# EasyEDA Pro project 三轴测试仪快速检测系统_2024-12-14.eprj, schematic Schematic1

## Sheets
1 采集系统: Board Name: Board1; Create Date: 2024-12-13; Page Name: 采集系统; Project Name: 三轴测试仪快速检测系统_2024-12-12; Schematic Name: Schematic1; Update Date: 2024-12-13; Company: 嘉立创EDA; Page Size: A4; Version: V1.0
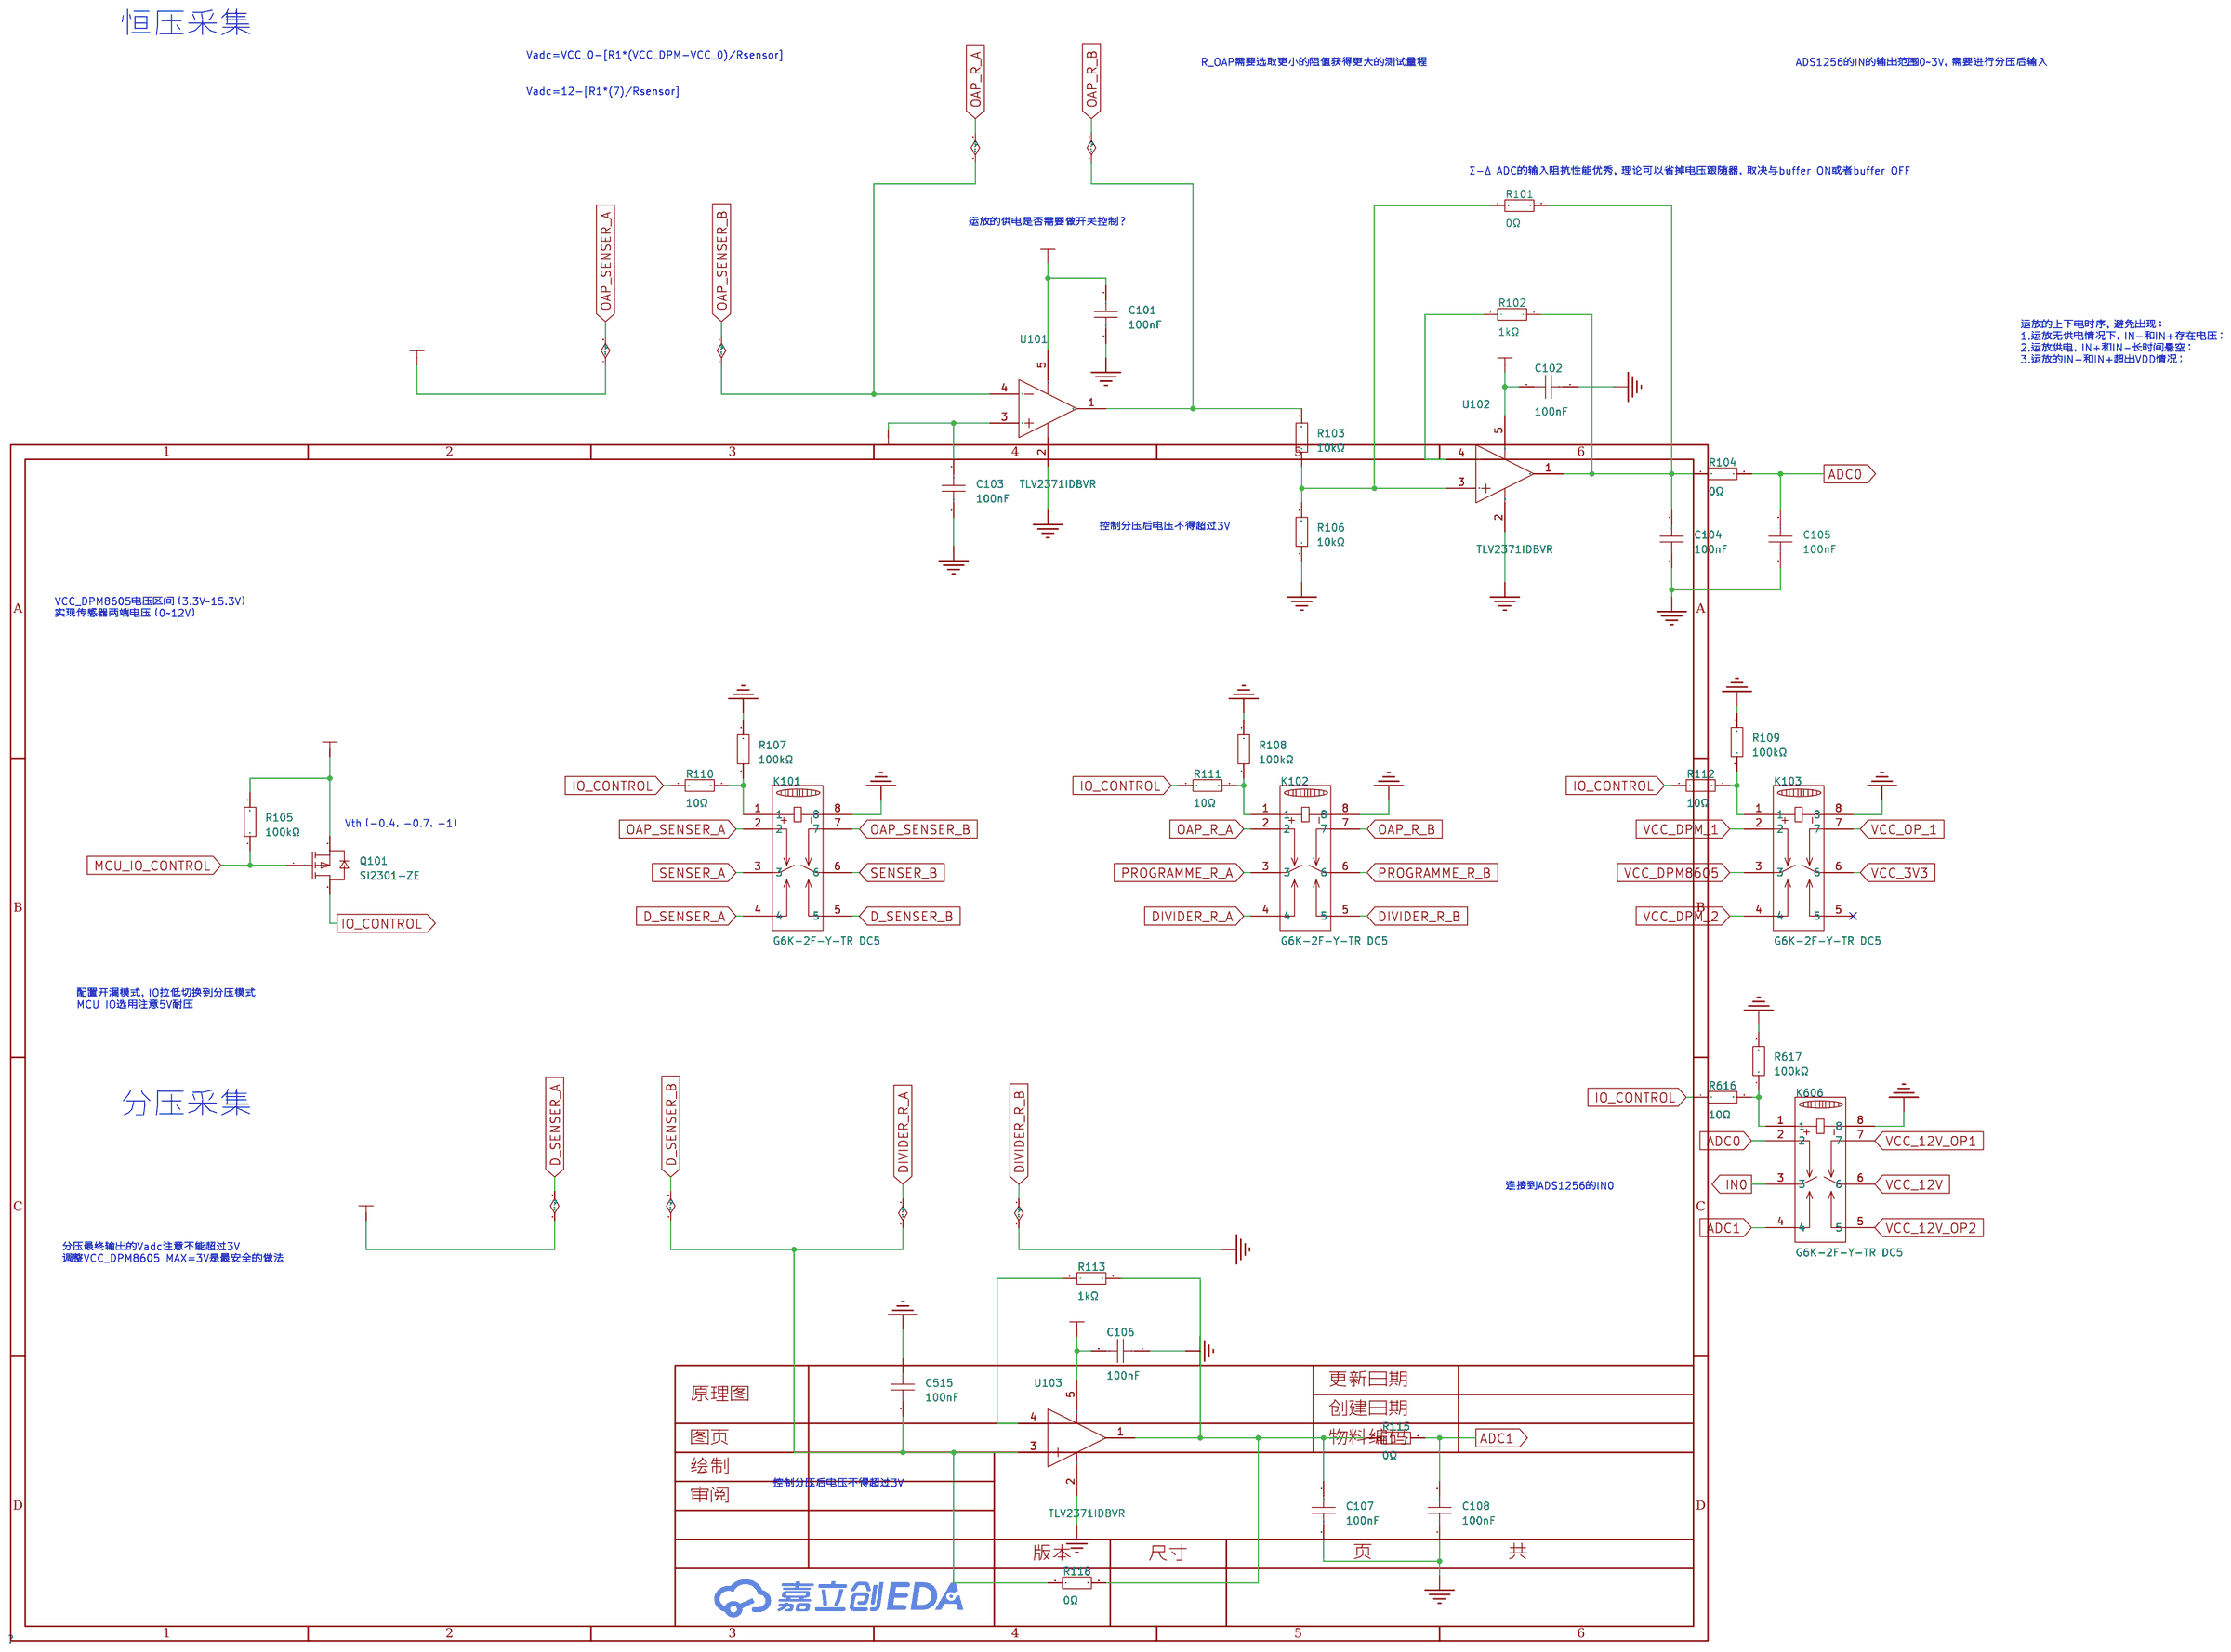
[diagram p0: 采集系统]
2 通讯部分: Page Name: 通讯部分
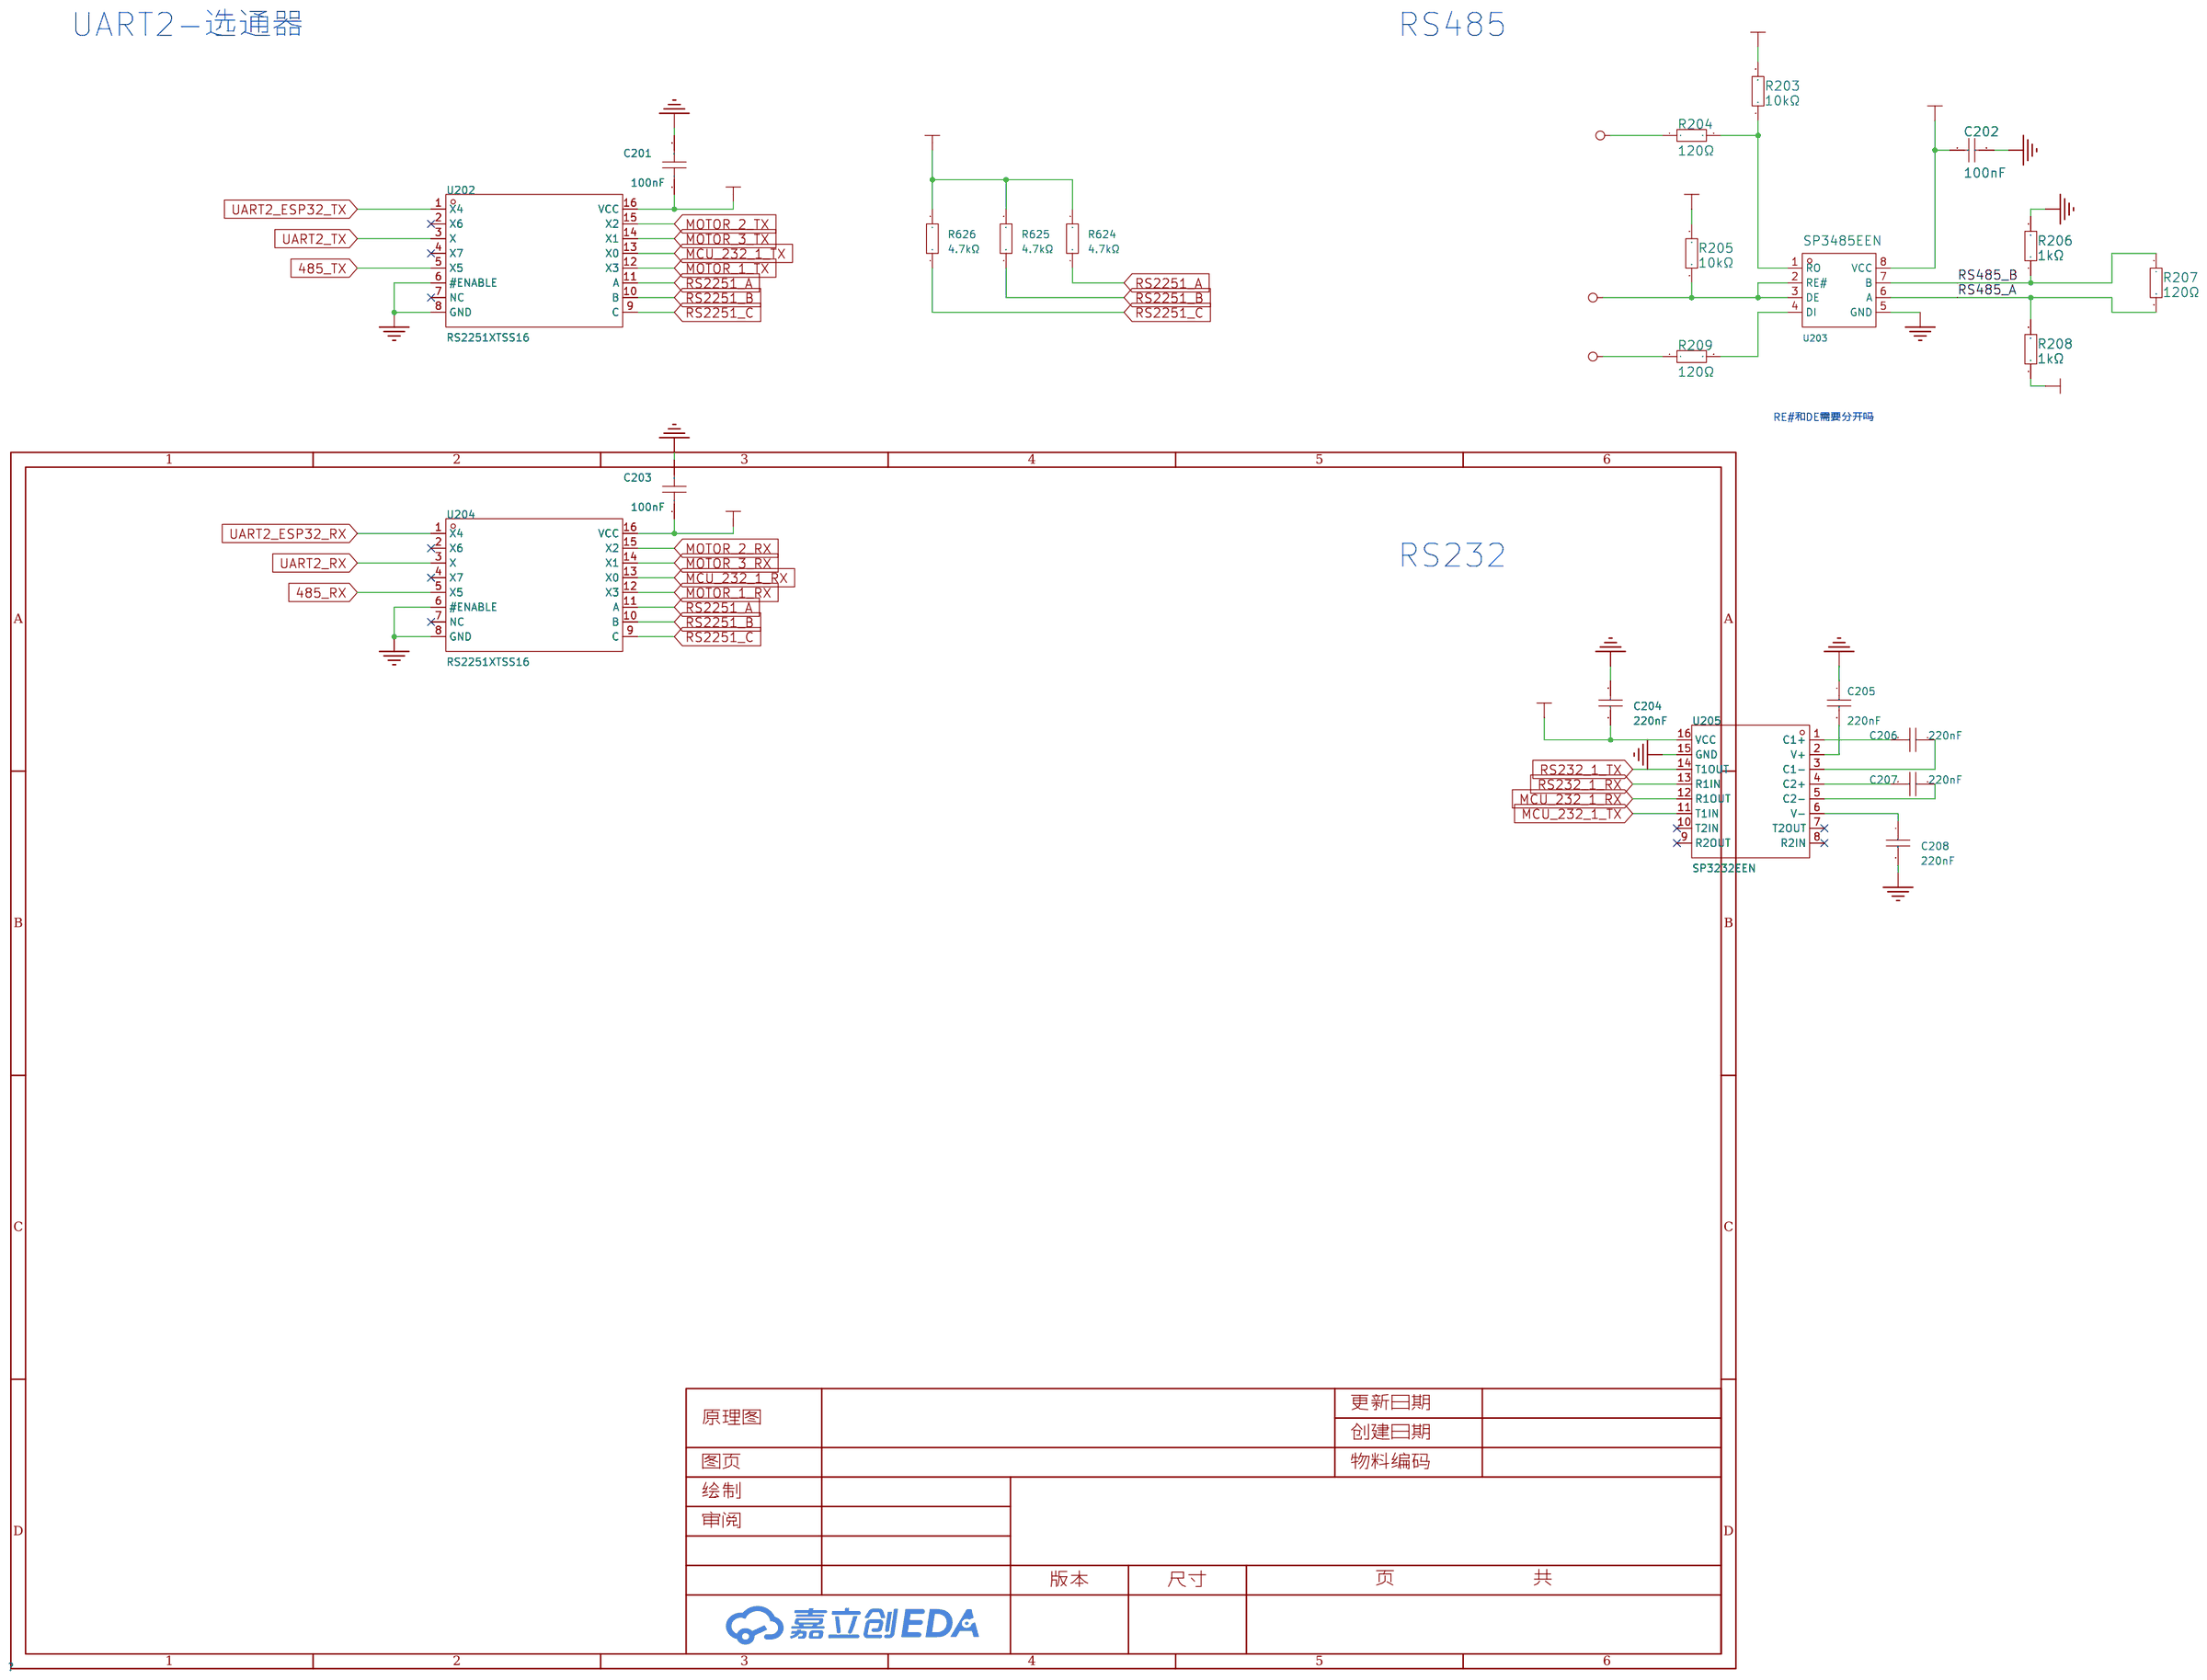
[diagram p1: 通讯部分]
3 POWER: Page Name: POWER
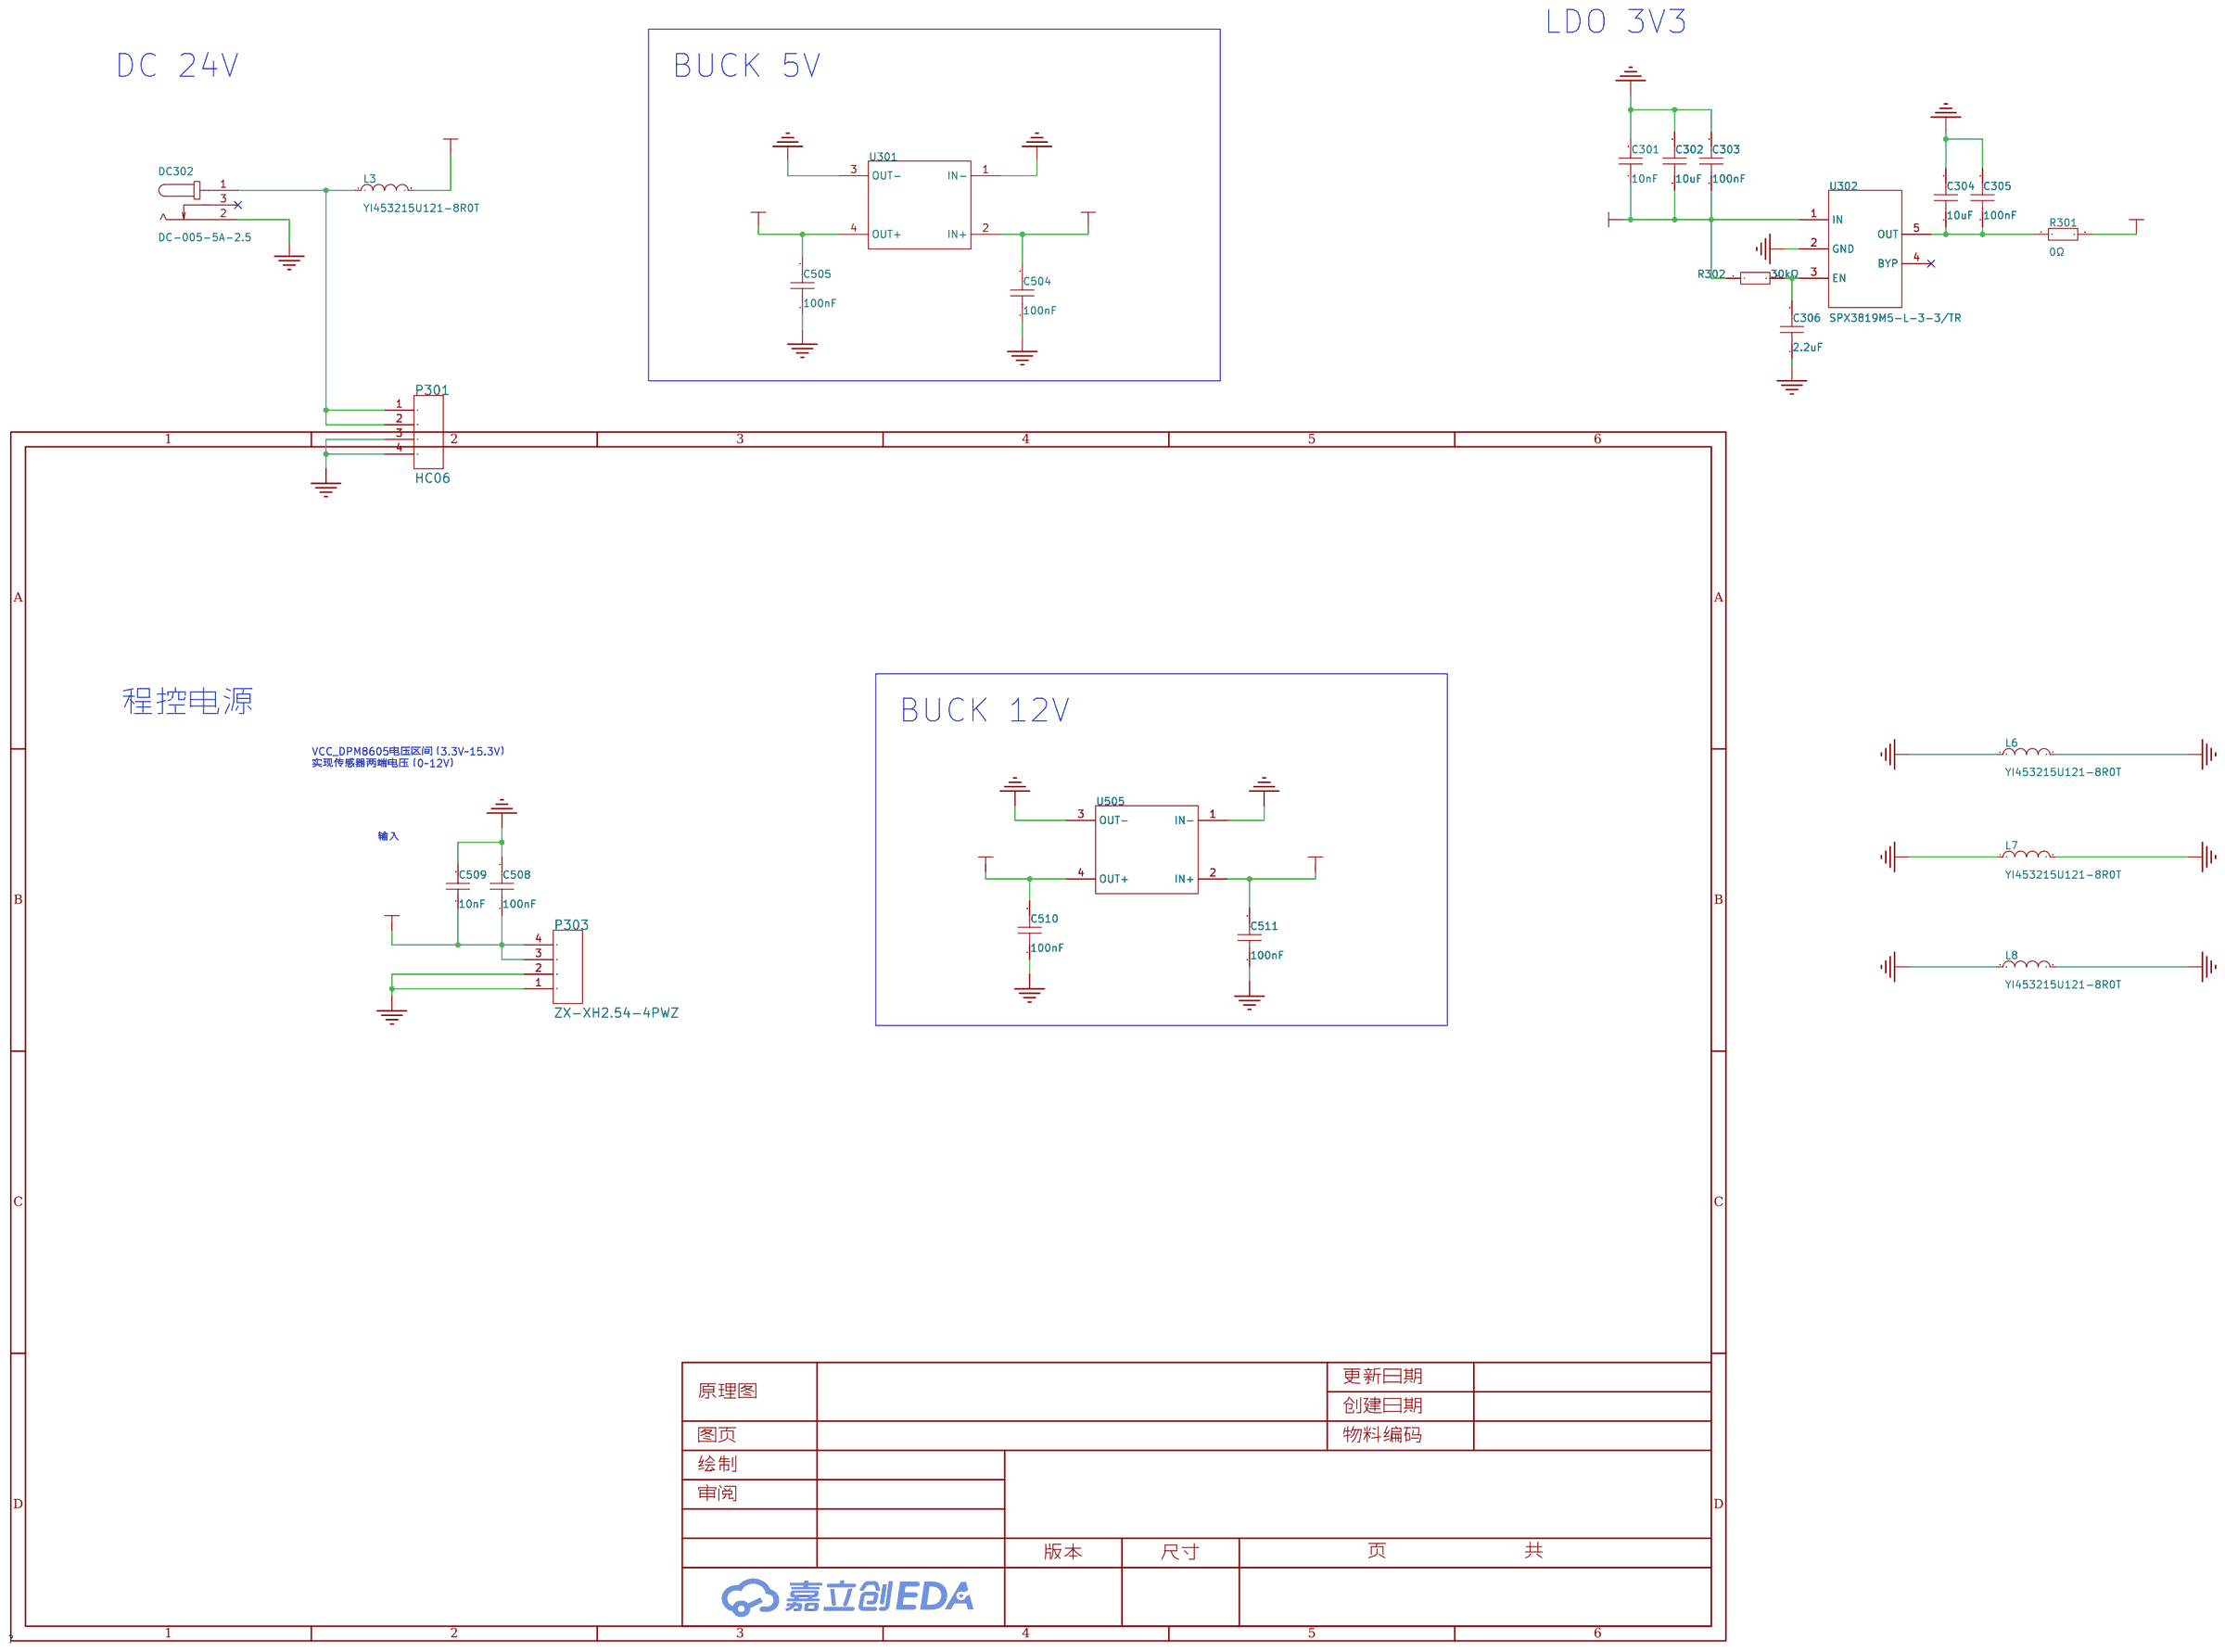
[diagram p2: POWER]
4 MCU: Create Date: 2024-12-14; Page Name: MCU; Project Name: 三轴测试仪快速检测系统_2024-12-14; Update Date: 2024-12-14
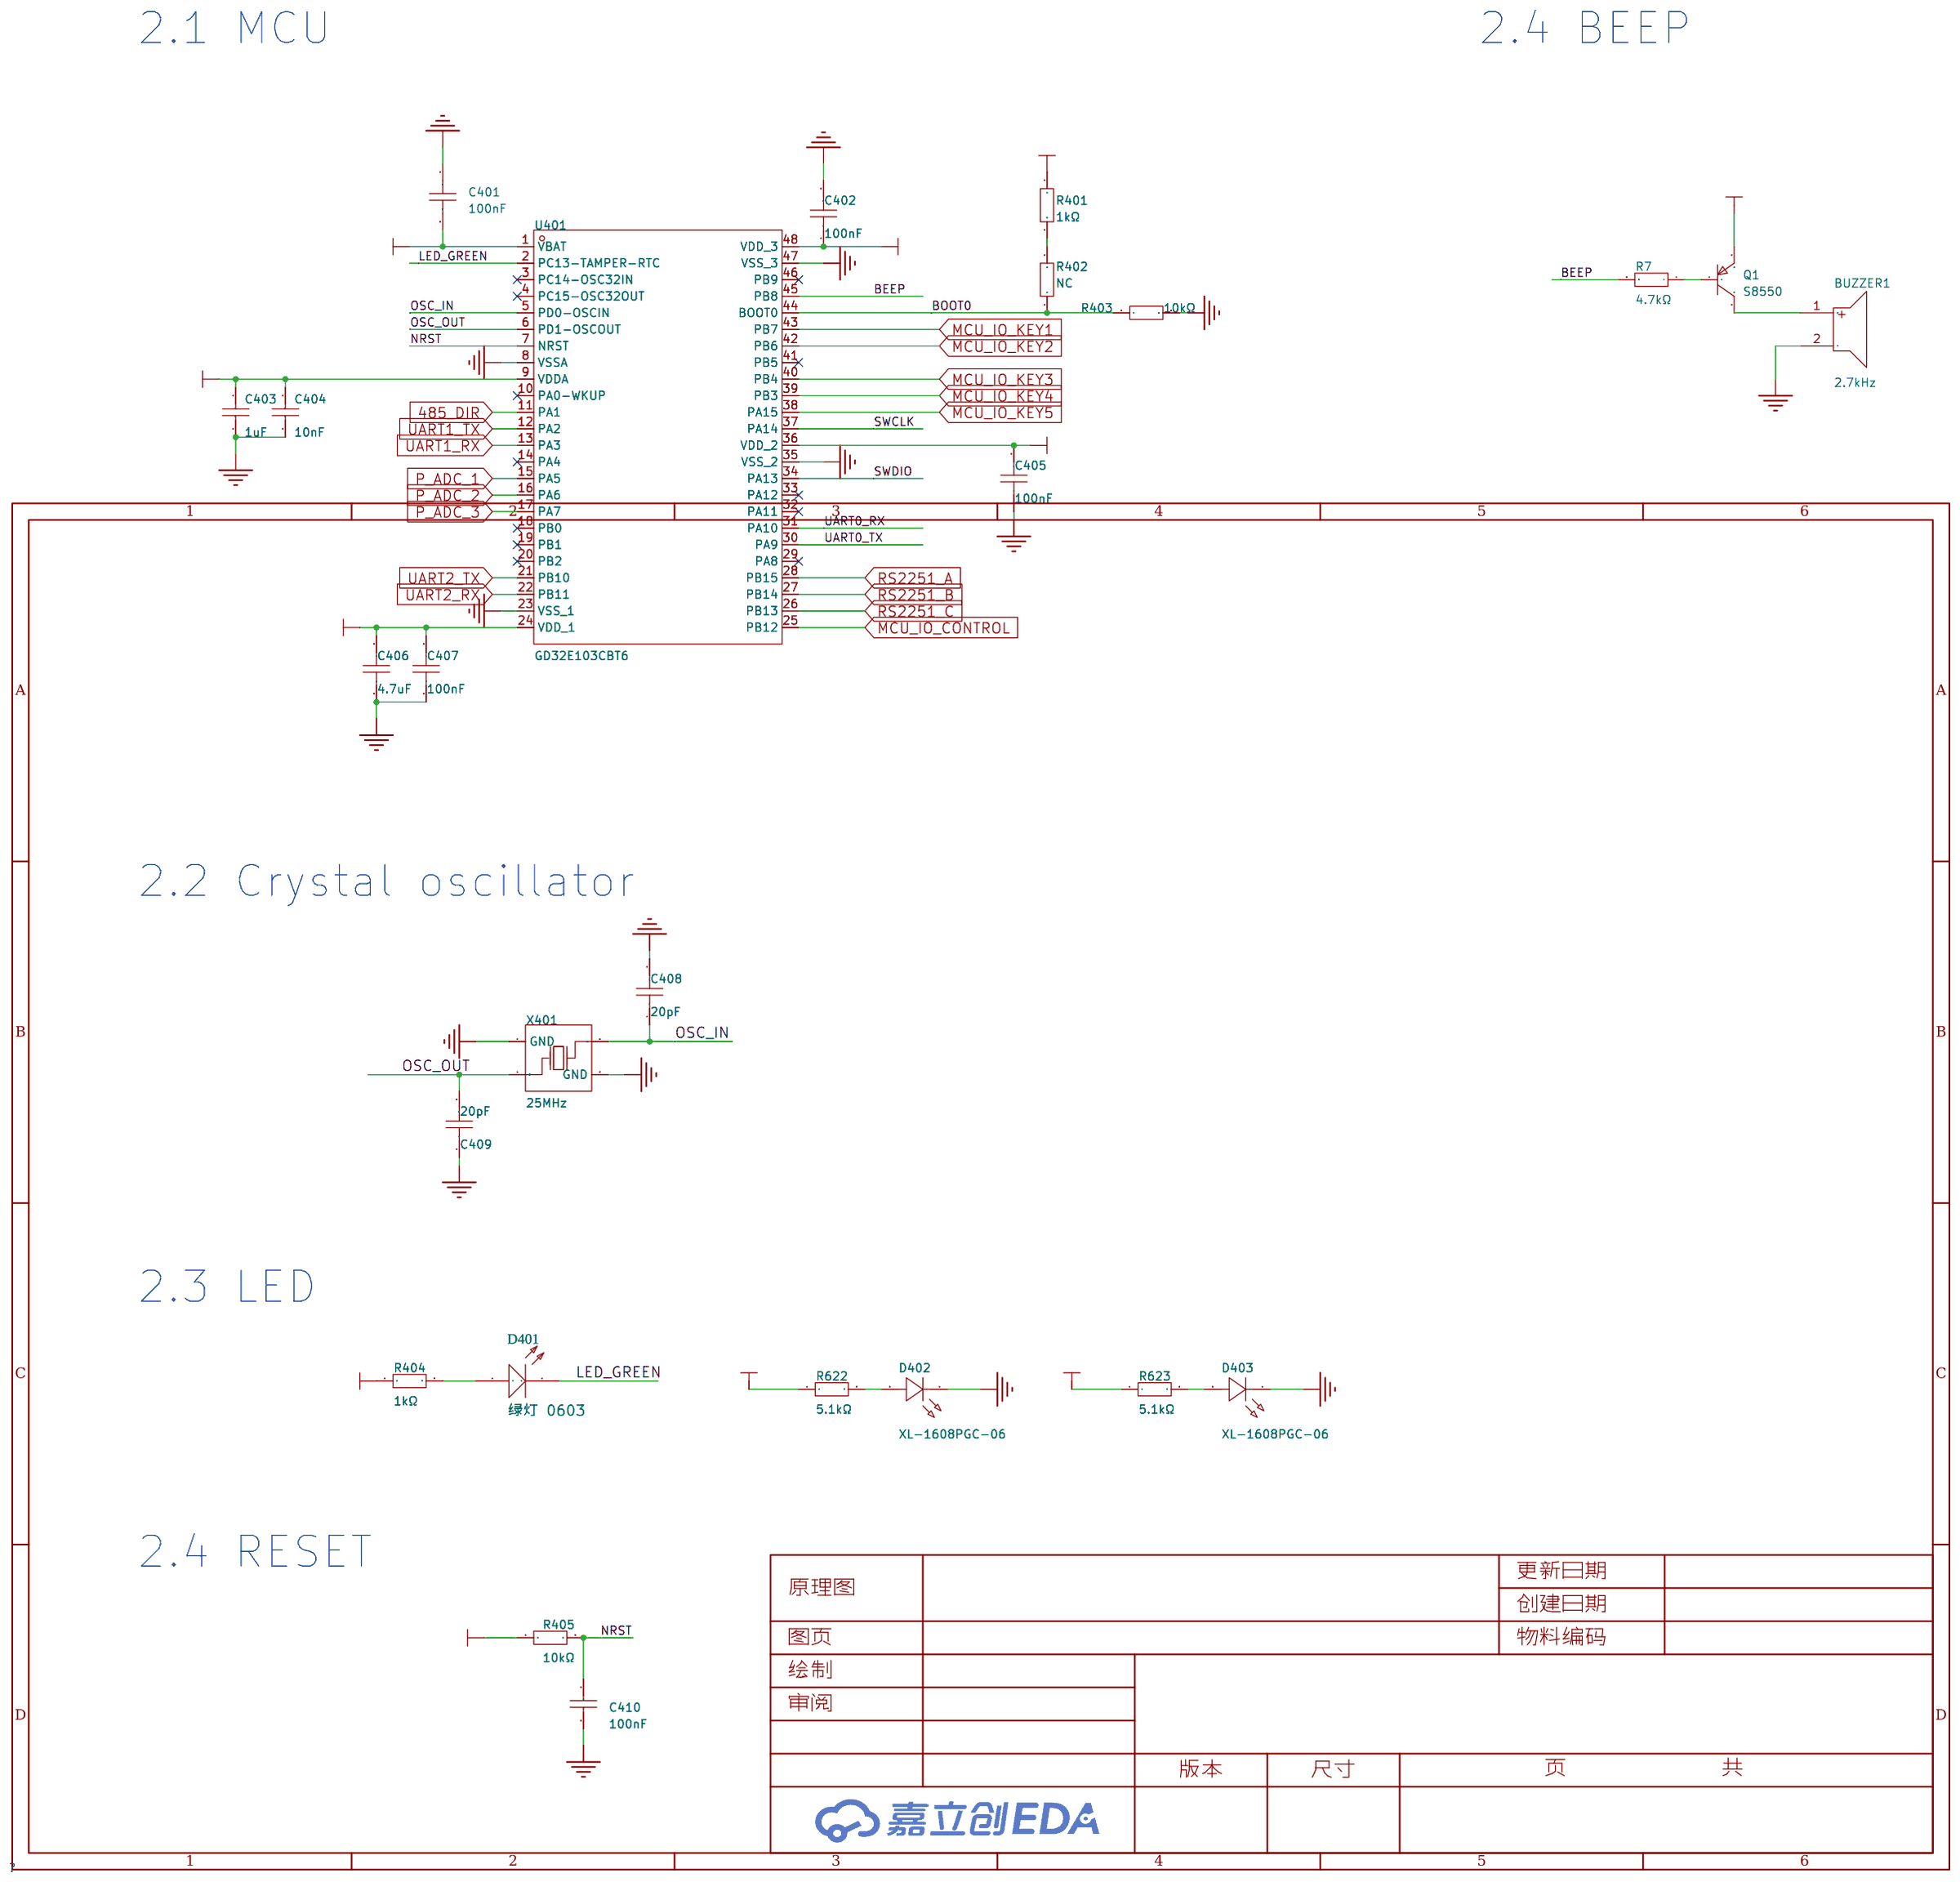
[diagram p3: MCU]
5 通讯接口: Page Name: 通讯接口
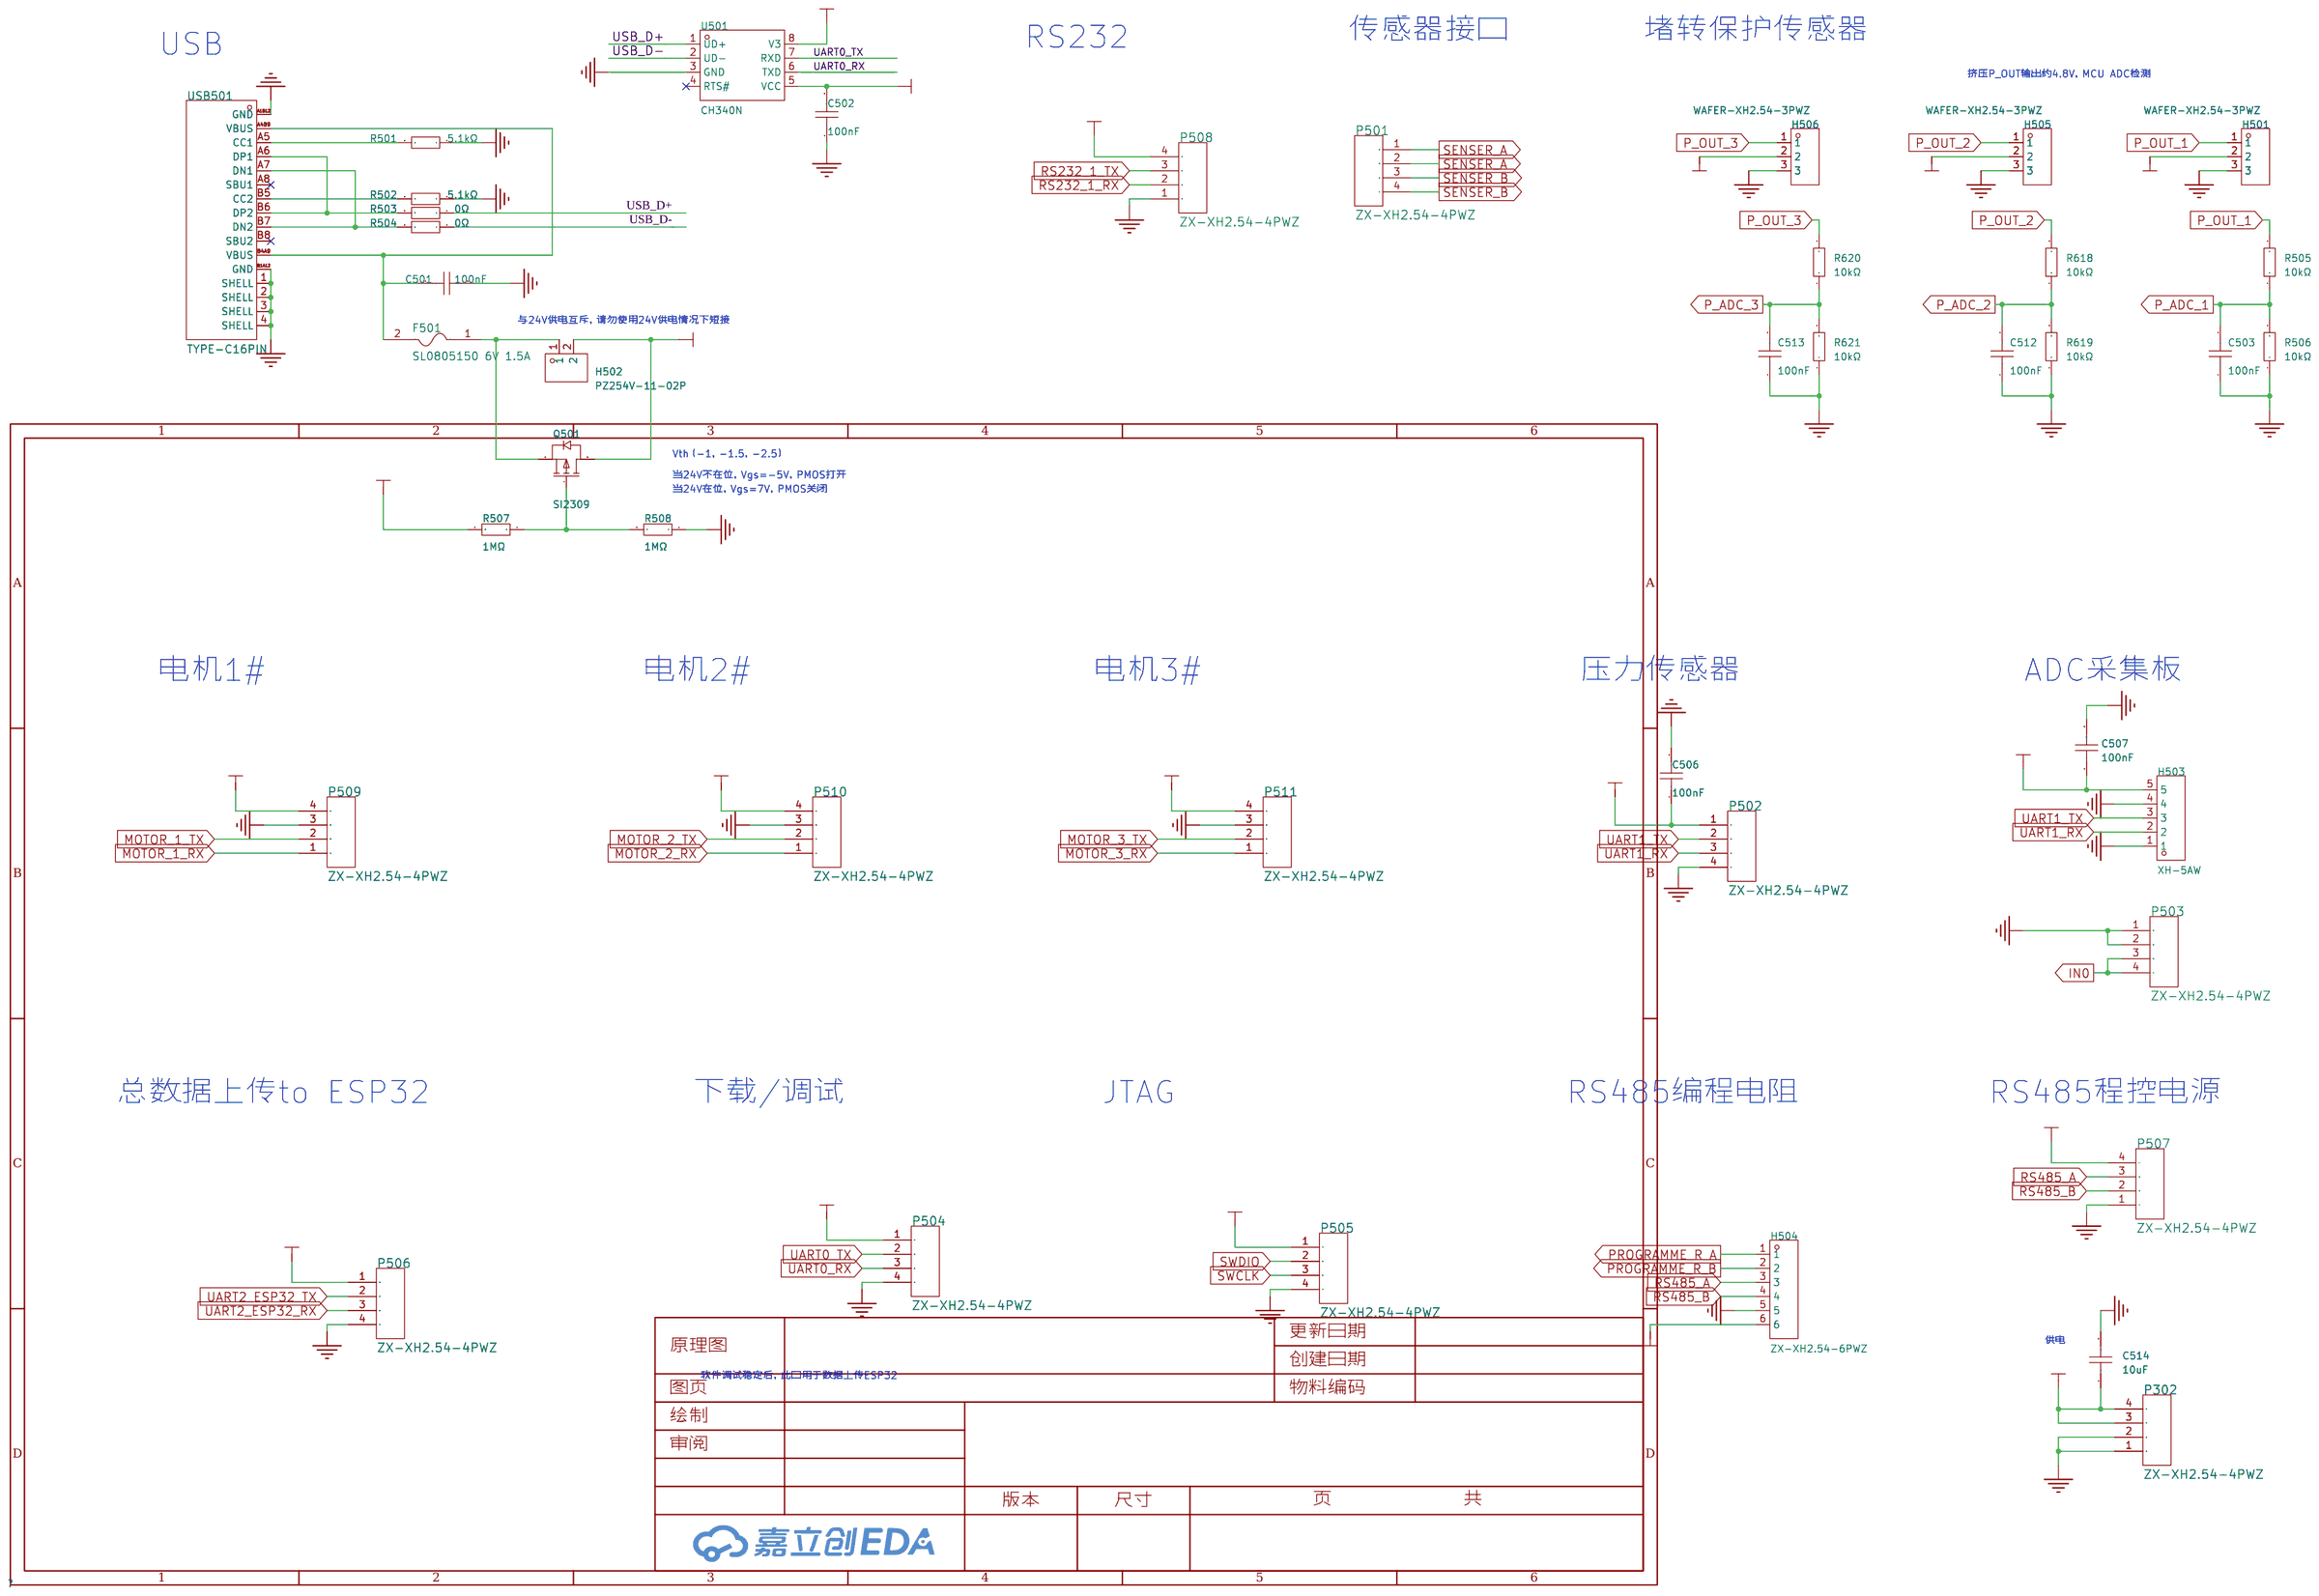
[diagram p4: 通讯接口]
6 按键接口: Create Date: 2024-12-14; Page Name: 按键接口; Project Name: 三轴测试仪快速检测系统_2024-12-14; Update Date: 2024-12-14
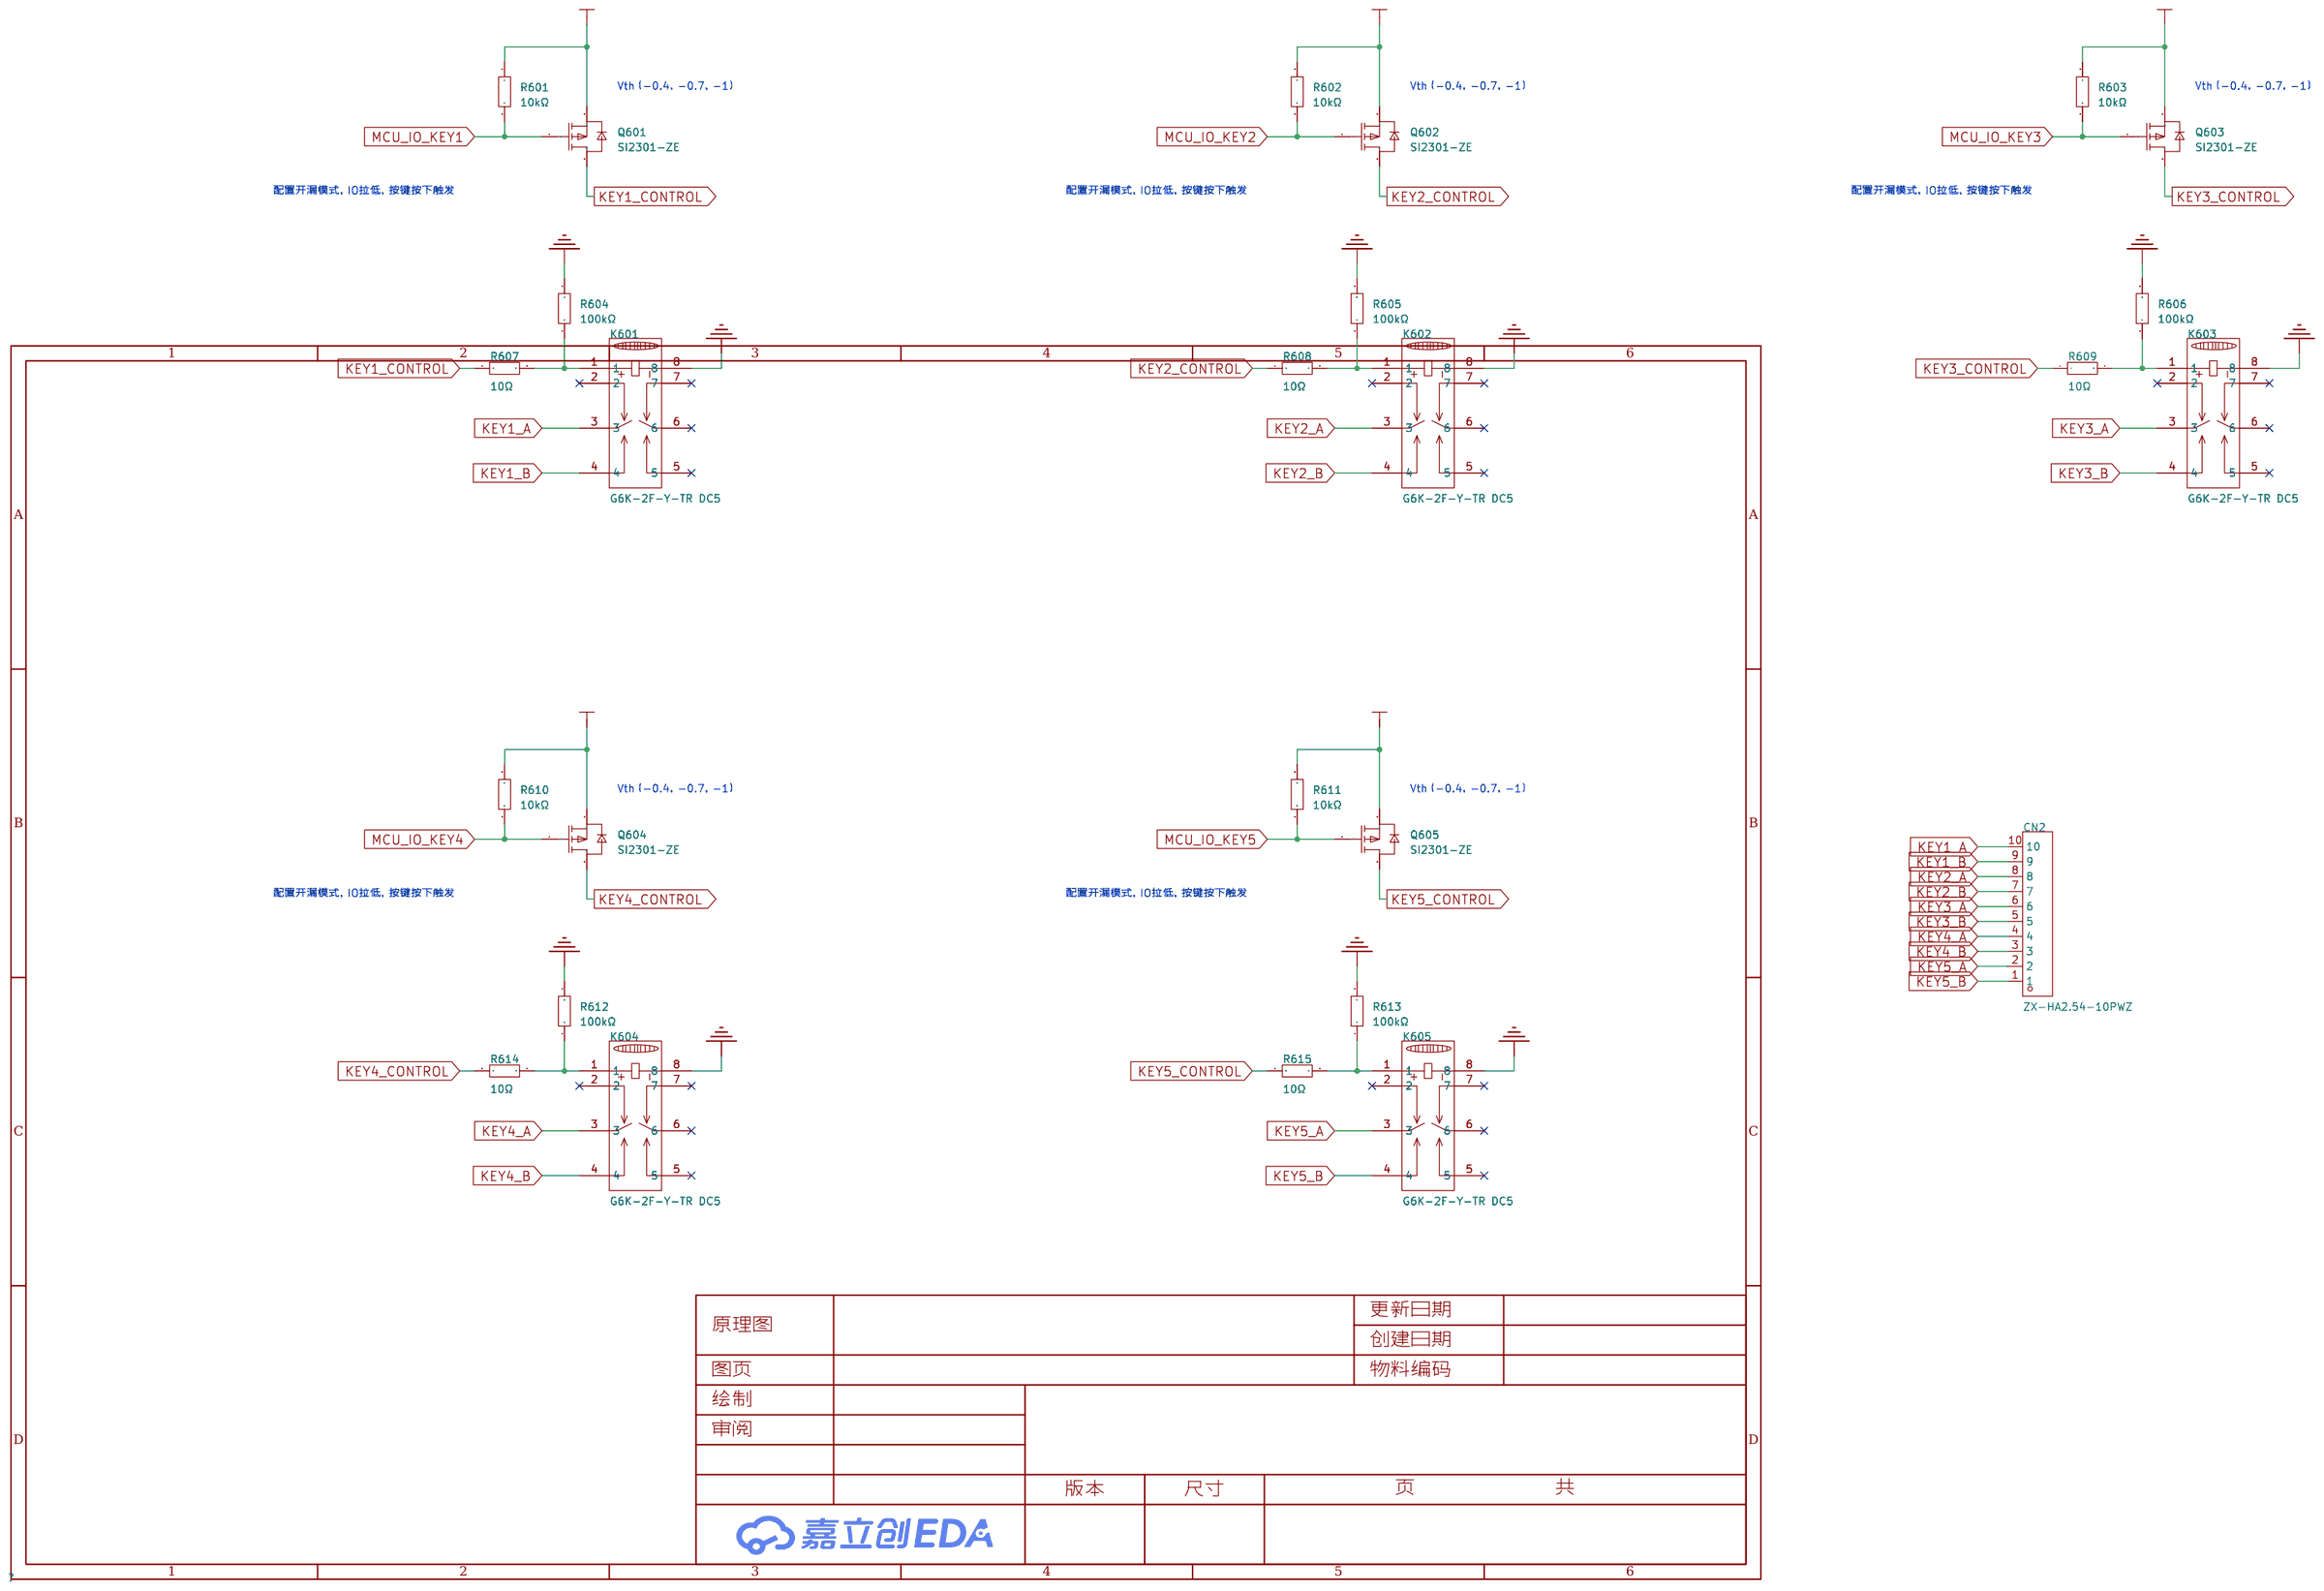
[diagram p5: 按键接口]

## Parts
sheet MCU
BUZZER1  2.7kHz  [BUZ-TH_BD9.0-P4.00-D0.6-FD]
C401  100nF  [C0402]
C402  100nF  [C0402]
C403  1uF  [C0402]
C404  10nF  [C0402]
C405  100nF  [C0402]
C406  4.7uF  [C0402]
C407  100nF  [C0402]
C408  20pF  [C0402]
C409  20pF  [C0402]
C410  100nF  [C0402]
D401  绿灯 0603  [0603_LED_S1]
D402  XL-1608PGC-06  [LED0603-RD_GREEN]
D403  XL-1608PGC-06  [LED0603-RD_GREEN]
Q1  S8550  [SOT-23-3_L2.9-W1.6-P1.90-LS2.8-BR]
R7  4.7kΩ  [R0402]
R401  1kΩ  [R0402]
R402  10kΩ  [R0201]
R403  10kΩ  [R0402]
R404  1kΩ  [R0402]
R405  10kΩ  [R0402]
R622  5.1kΩ  [R0603]
R623  5.1kΩ  [R0603]
U401  GD32E103CBT6  [LQFP-48_L7.0-W7.0-P0.50-LS9.0-BL]
X401  25MHz  [OSC-SMD_4P-L2.0-W1.6-BL]
sheet POWER
C301  10nF  [C0603]
C302  10uF  [C0603]
C303  100nF  [C0603]
C304  10uF  [C0603]
C305  100nF  [C0603]
C306  2.2uF  [C0603]
C504  100nF  [C0805]
C505  100nF  [C0603]
C508  100nF  [C0603]
C509  10nF  [C0603]
C510  100nF  [C0603]
C511  100nF  [C0805]
DC302  DC-005-5A-2.5  [DC-IN-TH_DC-005-5A-2.5]
L3  YI453215U121-8R0T  [IND-SMD_L4.5-W3.2-CBW453215U800T]
L6  YI453215U121-8R0T  [IND-SMD_L4.5-W3.2-CBW453215U800T]
L7  YI453215U121-8R0T  [IND-SMD_L4.5-W3.2-CBW453215U800T]  (no BOM)
L8  YI453215U121-8R0T  [IND-SMD_L4.5-W3.2-CBW453215U800T]  (no BOM)
P301  HC06  [HDR-TH_4P-P2.54-V-F-R1-C4]  (no BOM)
P303  ZX-XH2.54-4PWZ  [CONN-TH_4P-P2.50_ZX-XH2.54-4PWZ]
R301  0Ω  [R0603]
R302  30kΩ  [R0402]
U301  -  [DCDC_24-5]
U302  SPX3819M5-L-3-3/TR  [SOT-23-5_L3.0-W1.7-P0.95-LS2.8-BL]
U505  -  [DCDC_24-5]
sheet 按键接口
CN2  ZX-HA2.54-10PWZ  [CONN-TH_10P-P2.50_ZX-HA2.54-10PWZ]
K601  G6K-2F-Y-TR DC5  [RELAY-SMD_G6K-2F-X-XX]
K602  G6K-2F-Y-TR DC5  [RELAY-SMD_G6K-2F-X-XX]
K603  G6K-2F-Y-TR DC5  [RELAY-SMD_G6K-2F-X-XX]
K604  G6K-2F-Y-TR DC5  [RELAY-SMD_G6K-2F-X-XX]
K605  G6K-2F-Y-TR DC5  [RELAY-SMD_G6K-2F-X-XX]
Q601  SI2301-ZE  [SOT-23-3_L2.9-W1.3-P1.90-LS2.4-BR]
Q602  SI2301-ZE  [SOT-23-3_L2.9-W1.3-P1.90-LS2.4-BR]
Q603  SI2301-ZE  [SOT-23-3_L2.9-W1.3-P1.90-LS2.4-BR]
Q604  SI2301-ZE  [SOT-23-3_L2.9-W1.3-P1.90-LS2.4-BR]
Q605  SI2301-ZE  [SOT-23-3_L2.9-W1.3-P1.90-LS2.4-BR]
R601  10kΩ  [R0603]
R602  10kΩ  [R0603]
R603  10kΩ  [R0603]
R604  100kΩ  [R0603]
R605  100kΩ  [R0603]
R606  100kΩ  [R0603]
R607  10Ω  [R0603]
R608  10Ω  [R0603]
R609  10Ω  [R0603]
R610  10kΩ  [R0603]
R611  10kΩ  [R0603]
R612  100kΩ  [R0603]
R613  100kΩ  [R0603]
R614  10Ω  [R0603]
R615  10Ω  [R0603]
sheet 通讯接口
C501  100nF  [C0603]
C502  100nF  [C0402]
C503  100nF  [C0402]
C506  100nF  [C0603]
C507  100nF  [C0402]
C512  100nF  [C0402]
C513  100nF  [C0402]
C514  10uF  [C0805]
F501  SL0805150 6V 1.5A  [F0805]
H501  WAFER-XH2.54-3PWZ  [CONN-TH_3P-P2.50_WAFER-XH2.54-3PWZ]
H502  PZ254V-11-02P  [HDR-TH_2P-P2.54-V-M]
H503  XH-5AW  [CONN-TH_5P-P2.54_XH-5AW_C2908614]
H504  ZX-XH2.54-6PWZ  [CONN-TH_6P-P2.50_ZX-XH2.54-6PWZ]
H505  WAFER-XH2.54-3PWZ  [CONN-TH_3P-P2.50_WAFER-XH2.54-3PWZ]
H506  WAFER-XH2.54-3PWZ  [CONN-TH_3P-P2.50_WAFER-XH2.54-3PWZ]
P302  ZX-XH2.54-4PWZ  [CONN-TH_4P-P2.50_ZX-XH2.54-4PWZ]
P501  ZX-XH2.54-4PWZ  [CONN-TH_4P-P2.50_ZX-XH2.54-4PWZ]
P502  ZX-XH2.54-4PWZ  [CONN-TH_4P-P2.50_ZX-XH2.54-4PWZ]
P503  ZX-XH2.54-4PWZ  [CONN-TH_4P-P2.50_ZX-XH2.54-4PWZ]
P504  ZX-XH2.54-4PWZ  [CONN-TH_4P-P2.50_ZX-XH2.54-4PWZ]
P505  ZX-XH2.54-4PWZ  [CONN-TH_4P-P2.50_ZX-XH2.54-4PWZ]
P506  ZX-XH2.54-4PWZ  [CONN-TH_4P-P2.50_ZX-XH2.54-4PWZ]
P507  ZX-XH2.54-4PWZ  [CONN-TH_4P-P2.50_ZX-XH2.54-4PWZ]
P508  ZX-XH2.54-4PWZ  [CONN-TH_4P-P2.50_ZX-XH2.54-4PWZ]
P509  ZX-XH2.54-4PWZ  [CONN-TH_4P-P2.50_ZX-XH2.54-4PWZ]
P510  ZX-XH2.54-4PWZ  [CONN-TH_4P-P2.50_ZX-XH2.54-4PWZ]
P511  ZX-XH2.54-4PWZ  [CONN-TH_4P-P2.50_ZX-XH2.54-4PWZ]
Q501  SI2309  [SOT-23_L2.9-W1.3-P1.90-LS2.4-BR]
R501  5.1kΩ  [R0402]
R502  5.1kΩ  [R0402]
R503  0Ω  [R0402]
R504  0Ω  [R0402]
R505  10kΩ  [R0603]
R506  10kΩ  [R0603]
R507  1MΩ  [R0603]
R508  1MΩ  [R0603]
R618  10kΩ  [R0603]
R619  10kΩ  [R0603]
R620  10kΩ  [R0603]
R621  10kΩ  [R0603]
U501  CH340N  [SOP-8_L4.9-W3.9-P1.27-LS6.0-BL]
USB501  TYPE-C16PIN  [type-c16pin]
sheet 通讯部分
C201  100nF  [C0402]
C202  100nF  [C0402]
C203  100nF  [C0402]
C204  220nF  [C0603]
C205  220nF  [C0603]
C206  220nF  [C0603]
C207  220nF  [C0603]
C208  220nF  [C0603]
R203  10kΩ  [R0402]
R204  120Ω  [R0402]
R205  10kΩ  [R0402]
R206  1kΩ  [R0402]
R207  120Ω  [R0402]
R208  1kΩ  [R0402]
R209  120Ω  [R0402]
R624  4.7kΩ  [R0402]
R625  4.7kΩ  [R0402]
R626  4.7kΩ  [R0402]
U202  RS2251XTSS16  [TSSOP-16_L5.0-W4.4-P0.65-LS6.4-BL]
U203  SP3485EEN  [SOP-8_L5.0-W3.9-P1.27-LS6.0-BL]
U204  RS2251XTSS16  [TSSOP-16_L5.0-W4.4-P0.65-LS6.4-BL]
U205  SP3232EEN  [SOP-16_L9.9-W3.9-P1.27-LS6.0-BL]
sheet 采集系统
C101  100nF  [C0402]
C102  100nF  [C0402]
C103  100nF  [C0402]
C104  100nF  [C0603]  (no BOM)
C105  100nF  [C0603]  (no BOM)
C106  100nF  [C0402]
C107  100nF  [C0603]  (no BOM)
C108  100nF  [C0603]  (no BOM)
C515  100nF  [C0402]  (no BOM)
K101  G6K-2F-Y-TR DC5  [RELAY-SMD_G6K-2F-X-XX]
K102  G6K-2F-Y-TR DC5  [RELAY-SMD_G6K-2F-X-XX]
K103  G6K-2F-Y-TR DC5  [RELAY-SMD_G6K-2F-X-XX]
K606  G6K-2F-Y-TR DC5  [RELAY-SMD_G6K-2F-X-XX]
Q101  SI2301-ZE  [SOT-23-3_L2.9-W1.3-P1.90-LS2.4-BR]
R101  0Ω  [R0603]  (no BOM)
R102  1kΩ  [R0603]
R103  10kΩ  [R0603]
R104  0Ω  [R0603]
R105  100kΩ  [R0603]
R106  10kΩ  [R0603]
R107  100kΩ  [R0603]
R108  100kΩ  [R0603]
R109  100kΩ  [R0603]
R110  10Ω  [R0603]
R111  10Ω  [R0603]
R112  10Ω  [R0603]
R113  1kΩ  [R0603]
R115  0Ω  [R0603]
R118  0Ω  [R0603]  (no BOM)
R616  10Ω  [R0603]
R617  100kΩ  [R0603]
U101  TLV2371IDBVR  [SOT-23-5_L3.0-W1.7-P0.95-LS2.8-BR]
U102  TLV2371IDBVR  [SOT-23-5_L3.0-W1.7-P0.95-LS2.8-BR]
U103  TLV2371IDBVR  [SOT-23-5_L3.0-W1.7-P0.95-LS2.8-BR]

## Library data of the parts
BUZZER1 = QMB-09B-03: 驱动方式:无源(外部驱动);构造类型:电磁式;频率:2.7kHz;声压(SPL):85dB@3V,10cm;; LCSC Part Name: 无源蜂鸣器QMB-09B-03; Supplier Part: C96256; Manufacturer: 华能; Supplier Footprint: 插件,D=9mm; JLCPCB Part Class: 扩展库; Datasheet: https://atta.szlcsc.com/upload/public/pdf/source/20210401/C96256_958B17753B5AD7CBFBCFFC7C095B4484.pdf; Supplier: LCSC; Oscillator Circuit: 无源(外部驱动); Technology Type: 电磁式; Operating Voltage: 2V~5V; Sound Pressure Level (SPL): 85dB@3V,10cm; Diameter (φD): 9mm; Height: 5.7mm
C101-C103 C106 C401 C402 C405 C407 C410 C502 C503 C507 C512 C513 C515 = CL05B104KO5NNNC: 容值:100nF;精度:±10%;额定电压:16V;材质(温度系数):X7R;; LCSC Part Name: 100nF ±10% 16V; Supplier Part: C1525; Manufacturer: SAMSUNG(三星); Supplier Footprint: 0402; JLCPCB Part Class: Basic Part; Datasheet: https://atta.szlcsc.com/upload/public/pdf/source/20160218/1457707763339.pdf; Supplier: LCSC; Tolerance: ±10%; Voltage Rated: 16V; Temperature Coefficient: X7R
C403 = CL05A105KA5NQNC: LCSC Part Name: 1uF ±10% 25V; Supplier Part: C52923; Manufacturer: SAMSUNG(三星); Supplier Footprint: 0402; JLCPCB Part Class: Basic Part; Datasheet: https://atta.szlcsc.com/upload/public/pdf/source/20160218/1457707763339.pdf; Supplier: LCSC; Tolerance: ±10%; Voltage Rated: 25V; Temperature Coefficient: X5R
C404 = CL05B103KB5NNNC: LCSC Part Name: 10nF ±10% 50V; Supplier Part: C15195; Manufacturer: SAMSUNG(三星); Supplier Footprint: 0402; JLCPCB Part Class: Basic Part; Datasheet: https://atta.szlcsc.com/upload/public/pdf/source/20160218/1457707763339.pdf; Supplier: LCSC; Tolerance: ±10%; Voltage Rated: 50V; Temperature Coefficient: X7R
C406 = CL05A475MQ5NRNC: 容值:4.7uF;精度:±20%;额定电压:6.3V;材质(温度系数):X5R;; LCSC Part Name: 4.7uF ±20% 6.3V; Supplier Part: C307423; Manufacturer: SAMSUNG(三星); Supplier Footprint: 0402; JLCPCB Part Class: 扩展库; Datasheet: https://atta.szlcsc.com/upload/public/pdf/source/20181010/C307423_0E0C4E35F3A09F81C2E5C84E00499E42.pdf; Supplier: LCSC; Tolerance: ±20%; Voltage Rated: 6.3V; Temperature Coefficient: X5R
C408 C409 = 0402CG200J500NT: LCSC Part Name: 20pF ±5% 50V; Supplier Part: C1554; Manufacturer: FH(风华); Supplier Footprint: 0402; JLCPCB Part Class: Basic Part; Datasheet: https://atta.szlcsc.com/upload/public/pdf/source/20200305/C486355_26A10D38EF8C2A5C37091D0039909270.pdf; Supplier: LCSC; Tolerance: ±5%; Voltage Rated: 50V; Temperature Coefficient: C0G
D401 = 绿灯 0603: 发光二极管; ComponentLink1Description: 供应商链接; ComponentLink1URL: http://www.szlcsc.com/product/details_73152.html; Supplier: LC; SuppliersPartNumber: C72043; Design Item ID: 0603 绿灯; Library Name: 32x64_GD32E103VBT6
D402 D403 = XL-1608PGC-06: 灯头类型:-;发光颜色:翠绿色;正向电压(VF):2.6V~3V;功率:75mW;正向电流:5mA;主波长:505nm~540nm;二极管配置:-;透镜颜色:绿色透镜;色温:-;发光强度:299mcd;发光角度:130°;载带方式:正贴;工作温度:-;; Supplier Part: C7371905; Manufacturer: XINGLIGHT(成兴光); Supplier Footprint: 0603; JLCPCB Part Class: 扩展库; Datasheet: https://atta.szlcsc.com/upload/public/pdf/source/20240218/2F8A7AF596DEEB38157DAB7856E382C0.pdf; Supplier: LCSC; Emitted Color: 翠绿色; Forward Voltage (VF): 2.6V~3V; Power Dissipation: 75mW; Forward Current: 5mA; Dominant Wavelength: 505nm~540nm; Peak Wavelength: 530nm; Lens Color: 绿色透镜; Luminous Intensity: 299mcd; Viewing Angle: 130°; Mounting Sytle: 正贴
Q1 = S8550_C105432: 晶体管类型:PNP;集电极电流(Ic):500mA;集射极击穿电压(Vceo):25V;功率(Pd):300mW;直流电流增益(hFE@Ic,Vce):120@50mA,1V;; LCSC Part Name: S8550(RANGE:120-200) L档120-200; Supplier Part: C105432; Manufacturer: CJ(江苏长电/长晶); Supplier Footprint: SOT-23; JLCPCB Part Class: 基础库; Datasheet: https://atta.szlcsc.com/upload/public/pdf/source/20171228/C164891_15144412930301213894.pdf; Supplier: LCSC; Transistor Type: PNP; Collector Current (Ic): 500mA; Collector-Emitter Breakdown Voltage (Vceo): 25V; Power Dissipation (Pd): 300mW; DC Current Gain (hFE@Ic,Vce): 120@50mA,1V; Transition Frequency (fT): 150MHz; Collector Cut-Off Current (Icbo): 100nA; Collector-Emitter Saturation Voltage (VCE(sat)@Ic,Ib): 600mV@500mA,50mA
R7 R624-R626 = 0402WGF4701TCE: 电阻类型:厚膜电阻;阻值:4.7kΩ;精度:±1%;功率:62.5mW;最大工作电压:50V;温度系数:±100ppm/℃;; LCSC Part Name: 4.7kΩ ±1% 62.5mW 厚膜电阻; Supplier Part: C25900; Manufacturer: UNI-ROYAL(厚声); Supplier Footprint: 0402; JLCPCB Part Class: 基础库; Datasheet: https://atta.szlcsc.com/upload/public/pdf/source/20200306/C422600_1E6D84923E4A46A82E41ADD87F860B5C.pdf; Supplier: LCSC; Type: 厚膜电阻; Tolerance: ±1%; Power(Watts): 62.5mW; Overload Voltage (Max): 50V; Temperature Coefficient: ±100ppm/℃; Operating Temperature Range: -55℃~+155℃
R401 R404 = 0402WGF1001TCE: 电阻类型:厚膜电阻;阻值:1kΩ;精度:±1%;功率:62.5mW;最大工作电压:50V;温度系数:±100ppm/℃;; LCSC Part Name: 1kΩ ±1% 62.5mW 厚膜电阻; Supplier Part: C11702; Manufacturer: UNI-ROYAL(厚声); Supplier Footprint: 0402; JLCPCB Part Class: Basic Part; Datasheet: https://atta.szlcsc.com/upload/public/pdf/source/20200306/C422600_1E6D84923E4A46A82E41ADD87F860B5C.pdf; Supplier: LCSC; Type: 厚膜电阻; Tolerance: ±1%; Power(Watts): 62.5mW; Overload Voltage (Max): 50V; Temperature Coefficient: ±100ppm/℃; Operating Temperature Range: -55℃~+155℃
R402 = 0201WMF1002TEE: 电阻类型:厚膜电阻;阻值:10kΩ;精度:±1%;功率:50mW;最大工作电压:25V;温度系数:±200ppm/℃;; LCSC Part Name: 10kΩ ±1% 50mW 厚膜电阻; Supplier Part: C473048; Manufacturer: UNI-ROYAL(厚声); Supplier Footprint: 0201; JLCPCB Part Class: Extended Part; Datasheet: https://atta.szlcsc.com/upload/public/pdf/source/20200306/C422600_1E6D84923E4A46A82E41ADD87F860B5C.pdf; Supplier: LCSC; Type: 厚膜电阻; Tolerance: ±1%; Power(Watts): 50mW; Overload Voltage (Max): 25V; Temperature Coefficient: ±200ppm/℃; Operating Temperature Range: -55℃~+155℃
R403 R405 = 0402WGF1002TCE: 电阻类型:厚膜电阻;阻值:10kΩ;精度:±1%;功率:62.5mW;最大工作电压:50V;温度系数:±100ppm/℃;; LCSC Part Name: 10kΩ ±1% 62.5mW 厚膜电阻; Supplier Part: C25744; Manufacturer: UNI-ROYAL(厚声); Supplier Footprint: 0402; JLCPCB Part Class: Basic Part; Datasheet: https://atta.szlcsc.com/upload/public/pdf/source/20200306/C422600_1E6D84923E4A46A82E41ADD87F860B5C.pdf; Supplier: LCSC; Type: 厚膜电阻; Tolerance: ±1%; Power(Watts): 62.5mW; Overload Voltage (Max): 50V; Temperature Coefficient: ±100ppm/℃; Operating Temperature Range: -55℃~+155℃
R622 R623 = 0603WAF5101T5E: 电阻类型:厚膜电阻;阻值:5.1kΩ;精度:±1%;功率:100mW;最大工作电压:75V;温度系数:±100ppm/℃;; LCSC Part Name: 5.1kΩ ±1% 100mW 厚膜电阻; Supplier Part: C23186; Manufacturer: UNI-ROYAL(厚声); Supplier Footprint: 0603; JLCPCB Part Class: 基础库; Datasheet: https://atta.szlcsc.com/upload/public/pdf/source/20200306/C422600_1E6D84923E4A46A82E41ADD87F860B5C.pdf; Supplier: LCSC; Type: 厚膜电阻; Tolerance: ±1%; Power(Watts): 100mW; Overload Voltage (Max): 75V; Temperature Coefficient: ±100ppm/℃; Operating Temperature Range: -55℃~+155℃
U401 = GD32E103CBT6: LCSC Part Name: GD32E103CBT6 带CAN功能; Supplier Part: C2914253; Manufacturer: GigaDevice(兆易创新); Supplier Footprint: LQFP-48(7x7); JLCPCB Part Class: 扩展库; Datasheet: https://atta.szlcsc.com/upload/public/pdf/source/20201126/C350804_062D726FF1FE88D99C7604784B8D351C.pdf; Supplier: LCSC
X401 = 7F25000E20UCG: 晶振类型:贴片晶振;频率:25MHz;常温频差:±10ppm;外接负载电容:20pF;频率稳定度(全温):±30ppm;; LCSC Part Name: 25MHz ±10ppm 20pF; Supplier Part: C252274; Manufacturer: SJK(晶科鑫); Supplier Footprint: SMD2016-4P; JLCPCB Part Class: 扩展库; Datasheet: https://atta.szlcsc.com/upload/public/pdf/source/20220727/136062879A4A4DBFAFAE0FC3C83033A6.pdf; Supplier: LCSC; Crystal Type: 贴片晶振; Normal temperature Frequency Tolerance: ±10ppm; External load capacitor: 20pF; Frequency Stability(Full temperature range): ±30ppm; Operating Temperature: -40℃~+85℃
C301 C509 = 0603B103K500NT: 容值:10nF;精度:±10%;额定电压:50V;材质(温度系数):X7R;; LCSC Part Name: 10nF ±10% 50V; Supplier Part: C57112; Manufacturer: FH(风华); Supplier Footprint: 0603; JLCPCB Part Class: 基础库; Datasheet: https://atta.szlcsc.com/upload/public/pdf/source/20200305/C486355_26A10D38EF8C2A5C37091D0039909270.pdf; Supplier: LCSC; Tolerance: ±10%; Voltage Rated: 50V; Temperature Coefficient: X7R
C302 C304 = CL10A106MA8NRNC: 容值:10uF;精度:±20%;额定电压:25V;材质(温度系数):X5R;; LCSC Part Name: 10uF ±20% 25V; Supplier Part: C96446; Manufacturer: SAMSUNG(三星); Supplier Footprint: 0603; JLCPCB Part Class: 基础库; Datasheet: https://atta.szlcsc.com/upload/public/pdf/source/20160218/1457707763339.pdf; Supplier: LCSC; Tolerance: ±20%; Voltage Rated: 25V; Temperature Coefficient: X5R
C104 C105 C107 C108 C303 C305 C501 C505 C506 C508 C510 = CC0603KRX7R9BB104: 容值:100nF;精度:±10%;额定电压:50V;材质(温度系数):X7R;; LCSC Part Name: 100nF ±10% 50V; Supplier Part: C14663; Manufacturer: YAGEO(国巨); Supplier Footprint: 0603; JLCPCB Part Class: 基础库; Datasheet: https://atta.szlcsc.com/upload/public/pdf/source/20180910/C282072_33301C7F631E79921B82A8DAC6BCC5B3.pdf; Supplier: LCSC; Tolerance: ±10%; Voltage Rated: 50V; Temperature Coefficient: X7R
C306 = CL10A225KO8NNNC: 容值:2.2uF;精度:±10%;额定电压:16V;材质(温度系数):X5R;; LCSC Part Name: 2.2uF ±10% 16V; Supplier Part: C23630; Manufacturer: SAMSUNG(三星); Supplier Footprint: 0603; JLCPCB Part Class: Basic Part; Datasheet: https://atta.szlcsc.com/upload/public/pdf/source/20160218/1457707763339.pdf; Supplier: LCSC; Tolerance: ±10%; Voltage Rated: 16V; Temperature Coefficient: X5R
C504 C511 = CC0805KRX7R9BB104: 容值:100nF;精度:±10%;额定电压:50V;材质(温度系数):X7R;; LCSC Part Name: 100nF ±10% 50V; Supplier Part: C49678; Manufacturer: YAGEO(国巨); Supplier Footprint: 0805; JLCPCB Part Class: Basic Part; Datasheet: https://atta.szlcsc.com/upload/public/pdf/source/20180224/C181747_15194369449651363981.pdf; Supplier: LCSC; Tolerance: ±10%; Voltage Rated: 50V; Temperature Coefficient: X7R
DC302 = DC-005-5A-2.5: 连接器类型:DC电源插座;安装方式:弯插;触点内径:2.5mm;触点外径:6.5mm;额定电流:5A;额定电压:24V;工作温度范围:-20℃~+70℃;; LCSC Part Name: DC电源插座 内径:2.5mm 外径:6.5mm; Supplier Part: C381115; Manufacturer: XKB Connection(中国星坤); Supplier Footprint: 插件; JLCPCB Part Class: 扩展库; Datasheet: https://atta.szlcsc.com/upload/public/pdf/source/20220930/9F6B678D272419D8FE16D336E354A545.pdf; Supplier: LCSC; Connector Type: DC电源插座; Mounting Style: 弯插; Inside Contact Diameter: 2.5mm; Outside Contact Diameter: 6.5mm; Current Rating (Max): 5A; Voltage Rating (Max): 24V; Operating Temperature Range: -20℃~+70℃
L3 L6-L8 = YI453215U121-8R0T: 标称阻抗@测试频率:120Ω@100MHz;误差:±25%;直流电阻(RDC):10mΩ;; LCSC Part Name: 单路 1812磁珠 阻抗120Ω@100MHz; Supplier Part: C2858475; Manufacturer: YJYCOIN(益嘉源); Supplier Footprint: 1812; JLCPCB Part Class: 扩展库; Datasheet: https://atta.szlcsc.com/upload/public/pdf/source/20240109/C374FA4277F6E3A7C5BC25517D50BA8B.pdf; Supplier: LCSC; Impedance @ Frequency: 120Ω@100MHz; Tolerance: ±25%; DC Resistance: 10mΩ; Current Rating: 8A; Circuits: 1
P301 = HC06: Library Name: EMOWHH Make
P303 = ZX-XH2.54-4PWZ: 插针结构:1x4P;间距:2.54mm;安装方式:弯插;参考系列:XH;总PIN数:4P;排数:1;每排PIN数:4;行距:-;额定电流:3A;触头材质:黄铜;触头镀层:锡;工作温度范围:-25℃~+85℃;; Supplier Part: C7429643; Manufacturer: Megastar(兆星); Supplier Footprint: 弯插,P=2.54mm; JLCPCB Part Class: 扩展库; Datasheet: https://atta.szlcsc.com/upload/public/pdf/source/20230619/8DC602C7BA46C153FF1BE89D90453879.pdf; Supplier: LCSC; Pins Structure: 1x4P; Pitch: 2.54mm; Mounting Style: 弯插; Reference Series: XH; Number of Pins: 4P; Number of Rows: 1; Number of PINs Per Row: 4; Current Rating (Max): 3A; Contact Material: 黄铜; Contact Plating: 锡; Operating Temperature Range: -25℃~+85℃
R101 R104 R115 R118 R301 = 0603WAF0000T5E: 电阻类型:厚膜电阻;阻值:0Ω;精度:±1%;功率:100mW;最大工作电压:75V;; LCSC Part Name: 0Ω ±1% 100mW 厚膜电阻; Supplier Part: C21189; Manufacturer: UNI-ROYAL(厚声); Supplier Footprint: 0603; JLCPCB Part Class: 基础库; Datasheet: https://atta.szlcsc.com/upload/public/pdf/source/20200306/C422600_1E6D84923E4A46A82E41ADD87F860B5C.pdf; Supplier: LCSC; Type: 厚膜电阻; Tolerance: ±1%; Power(Watts): 100mW; Overload Voltage (Max): 75V; Operating Temperature Range: -55℃~+155℃
R302 = 0402WGF3002TCE: 电阻类型:厚膜电阻;阻值:30kΩ;精度:±1%;功率:62.5mW;最大工作电压:50V;温度系数:±100ppm/℃;; LCSC Part Name: 30kΩ ±1% 62.5mW 厚膜电阻; Supplier Part: C25776; Manufacturer: UNI-ROYAL(厚声); Supplier Footprint: 0402; JLCPCB Part Class: Extended Part; Datasheet: https://atta.szlcsc.com/upload/public/pdf/source/20200306/C422600_1E6D84923E4A46A82E41ADD87F860B5C.pdf; Supplier: LCSC; Type: 厚膜电阻; Tolerance: ±1%; Power(Watts): 62.5mW; Overload Voltage (Max): 50V; Temperature Coefficient: ±100ppm/℃; Operating Temperature Range: -55℃~+155℃
U301 U505 = DCDC_24-5模块: 焊盘2.2*3mm
U302 = SPX3819M5-L-3-3/TR: 输出类型:固定;最大输入电压:16V;输出电压:3.3V;输出电流:500mA;电源纹波抑制比(PSRR):70dB;输出极性:正极;; LCSC Part Name: 输入16V 输出3.3V 500mA; Supplier Part: C9055; Manufacturer: MaxLinear(迈凌); Supplier Footprint: SOT-23-5; JLCPCB Part Class: 扩展库; Datasheet: https://atta.szlcsc.com/upload/public/pdf/source/20150720/1457707331934.pdf; Supplier: LCSC; Output Type: 固定; Maximum Input Voltage: 16V; Output Voltage: 3.3V; Output Current: 500mA; Power Supply Rejection Ratio (PSRR): 70dB; Dropout Voltage: 700mV@(500mA); standby current: 8uA; Feature: 防静电保护；热保护(TSD)；过流保护(OCP)；带使能; Operating Temperature: -40℃~+125℃; Output Polarity: 正极; Number of Outputs: 1
CN2 = ZX-HA2.54-10PWZ: 插针结构:1x10P;间距:2.54mm;安装方式:弯插;参考系列:XH;总PIN数:10P;排数:1;每排PIN数:10;行距:-;额定电流:3A;触头材质:黄铜;触头镀层:锡;工作温度范围:-25℃~+85℃;; LCSC Part Name: 1x10P 间距:2.54mm 弯插 系列:XH/HA带扣; Supplier Part: C7429631; Manufacturer: Megastar(兆星); Supplier Footprint: 弯插,P=2.54mm; JLCPCB Part Class: 扩展库; Datasheet: https://atta.szlcsc.com/upload/public/pdf/source/20230619/D29CADD263BD71E104B200E9D39A0A9C.pdf; Supplier: LCSC; Pins Structure: 1x10P; Pitch: 2.54mm; Mounting Style: 弯插; Reference Series: XH; Number of Pins: 10P; Number of Rows: 1; Number of PINs Per Row: 10; Current Rating (Max): 3A; Contact Material: 黄铜; Contact Plating: 锡; Operating Temperature Range: -25℃~+85℃
K101-K103 K601-K606 = G6K-2F-Y-TR DC5: 线圈电压:5V;触点形式:两组转换:2C(双刀双掷-转换);触点容量(电阻负载):-;最大切换电压:125V@AC；60V@DC;最大切换电流:1A;; Supplier Part: C47190; Manufacturer: OMRON(欧姆龙); Supplier Footprint: SMD,6.5x10mm; JLCPCB Part Class: 扩展库; Datasheet: https://atta.szlcsc.com/upload/public/pdf/source/20220125/C1876770_53E5491D4B68F29C4BBD8118E9BAE0E8.pdf; Supplier: LCSC; Coil Voltage: 5V; Contact Form: 两组转换:2C(双刀双掷-转换); Maximum Switching Voltage: 125V@AC；60V@DC; Contact Material: 银+镀金; Maximum Switching Current: 1A; Operate Time: 3ms; Release Time: 3ms; Operating Temperature: -40℃~+70℃
Q101 Q601-Q605 = SI2301-ZE: 类型:P沟道;漏源电压(Vdss):20V;连续漏极电流(Id):2.3A;功率(Pd):700mW;导通电阻(RDS(on)@Vgs,Id):126mΩ@4.5V;阈值电压(Vgs(th)@Id):1V@250uA;; LCSC Part Name: P沟道 耐压:20V 电流:2.3A; Supplier Part: C5261052; Manufacturer: HXY MOSFET(华轩阳电子); Supplier Footprint: SOT-23; Datasheet: https://atta.szlcsc.com/upload/public/pdf/source/20230515/2FF2907841563ED329594D3237822724.pdf; Supplier: LCSC; Type: P沟道; Drain Source Voltage (Vdss): 20V; Continuous Drain Current (Id): 2.3A; Power Dissipation (Pd): 700mW; Drain Source On Resistance (RDS(on)@Vgs,Id): 126mΩ@4.5V; Gate Threshold Voltage (Vgs(th)@Id): 1V@250uA; Input Capacitance (Ciss@Vds): 285pF
R103 R106 R505 R506 R601-R603 R610 R611 R618-R621 = 0603WAF1002T5E: 电阻类型:厚膜电阻;阻值:10kΩ;精度:±1%;功率:100mW;最大工作电压:75V;温度系数:±100ppm/℃;; LCSC Part Name: 厚膜电阻 10kΩ ±1% 100mW; Supplier Part: C25804; Manufacturer: UNI-ROYAL(厚声); Supplier Footprint: 0603; JLCPCB Part Class: 基础库; Datasheet: https://atta.szlcsc.com/upload/public/pdf/source/20200306/C422600_1E6D84923E4A46A82E41ADD87F860B5C.pdf; Supplier: LCSC; Type: 厚膜电阻; Tolerance: ±1%; Power(Watts): 100mW; Overload Voltage (Max): 75V; Temperature Coefficient: ±100ppm/℃; Operating Temperature Range: -55℃~+155℃
R107-R109 R604-R606 R612 R613 R617 = 0603WAF1003T5E: 电阻类型:厚膜电阻;阻值:100kΩ;精度:±1%;功率:100mW;最大工作电压:75V;温度系数:±100ppm/℃;; LCSC Part Name: 100kΩ ±1% 100mW 厚膜电阻; Supplier Part: C25803; Manufacturer: UNI-ROYAL(厚声); Supplier Footprint: 0603; JLCPCB Part Class: 基础库; Datasheet: https://atta.szlcsc.com/upload/public/pdf/source/20200306/C422600_1E6D84923E4A46A82E41ADD87F860B5C.pdf; Supplier: LCSC; Type: 厚膜电阻; Tolerance: ±1%; Power(Watts): 100mW; Overload Voltage (Max): 75V; Temperature Coefficient: ±100ppm/℃; Operating Temperature Range: -55℃~+155℃
R110-R112 R607-R609 R614-R616 = 0603WAF100JT5E: 电阻类型:厚膜电阻;阻值:10Ω;精度:±1%;功率:100mW;最大工作电压:75V;温度系数:±400ppm/℃;; LCSC Part Name: 10Ω ±1% 100mW 厚膜电阻; Supplier Part: C22859; Manufacturer: UNI-ROYAL(厚声); Supplier Footprint: 0603; JLCPCB Part Class: 基础库; Datasheet: https://atta.szlcsc.com/upload/public/pdf/source/20200306/C422600_1E6D84923E4A46A82E41ADD87F860B5C.pdf; Supplier: LCSC; Type: 厚膜电阻; Tolerance: ±1%; Power(Watts): 100mW; Overload Voltage (Max): 75V; Temperature Coefficient: ±400ppm/℃; Operating Temperature Range: -55℃~+155℃
C514 = GRM21BR61H106KE43L: 容值:10uF;精度:±10%;额定电压:50V;材质(温度系数):X5R;; LCSC Part Name: 10uF ±10% 50V; Supplier Part: C440198; Manufacturer: muRata(村田); Supplier Footprint: 0805; JLCPCB Part Class: 基础库; Datasheet: https://atta.szlcsc.com/upload/public/pdf/source/20230811/95AAE0C9AF55EDC31B7A4D8B733F534E.pdf; Supplier: LCSC; Tolerance: ±10%; Voltage Rated: 50V; Temperature Coefficient: X5R
F501 = SL0805150 6V 1.5A: Supplier: LCSC; Manufacturer: TECHFUSE; Manufacturer Part: SL0805150; Supplier Part: C70156; JLCPCB Part Class: Extended Part; Design Item ID: SL0805150; Library Name: chaoning_Integrated_Library
H501 H505 H506 = WAFER-XH2.54-3PWZ: 插针结构:1x3P;间距:2.54mm;安装方式:弯插;总PIN数:3P;排数:1;每排PIN数:3;额定电流:2A;工作温度范围:-25℃~+85℃;; LCSC Part Name: XH 2.54mm 1x3P 弯插; Supplier Part: C5374806; Manufacturer: XUNPU(讯普); Supplier Footprint: 弯插,P=2.5mm; JLCPCB Part Class: Extended Part; Supplier: LCSC; Pins Structure: 1x3P; Pitch: 2.54mm; Mounting Style: 弯插; Number of Pins: 3P; Number of Rows: 1; Number of PINs Per Row: 3; Current Rating (Max): 2A; Operating Temperature Range: -25℃~+85℃
H502 = PZ254V-11-02P: 插针结构:1x2P;间距:2.54mm;行距:-;圆针/方针:方针;安装类型:直插;排数:单排;总PIN位数:2P;额定电流:-;额定电压:-;配合针长度:6mm;塑高:2.5mm;端接针长度:3mm;触头材质:黄铜;触头镀层:-;工作温度范围:-40℃~+105℃;颜色:黑色;; LCSC Part Name: 间距:2.54mm 1x2P 直插 方针; Supplier Part: C492401; Manufacturer: XFCN(兴飞); Supplier Footprint: 插件,P=2.54mm; JLCPCB Part Class: 扩展库; Datasheet: https://atta.szlcsc.com/upload/public/pdf/source/20200309/C492401_A812433581A9B211A7FFA413ADDFF0E5.pdf; Supplier: LCSC; Pin Structure: 1x2P; Pitch: 2.54mm; Circluar Pins/Square Pins: 方针; Mounting Type: 直插; Number of Rows: 单排; Number of Pins: 2P; Length of Mating Pin: 6mm; Insulation Height: 2.5mm; Length of End Connection Pin: 3mm; Contact Material: 黄铜; Operating Temperature Range: -40℃~+105℃; Color: 黑色
H503 = XH-5AW: 插针结构:1x5P;间距:2.54mm;安装方式:弯插;参考系列:XH;总PIN数:5P;排数:1;每排PIN数:5;行距:-;额定电流:3A;触头材质:黄铜;触头镀层:锡;工作温度范围:-25℃~+85℃;; LCSC Part Name: 1x5P 间距:2.54mm 弯插 系列:XH; Supplier Part: C2908614; Manufacturer: HCTL(华灿天禄); Supplier Footprint: 弯插,P=2.5mm; JLCPCB Part Class: Extended Part; Datasheet: https://atta.szlcsc.com/upload/public/pdf/source/20230711/B565BAF3B11666EF6B81B3605408F2BD.pdf; Supplier: LCSC; Pins Structure: 1x5P; Pitch: 2.54mm; Mounting Style: 弯插; Reference Series: XH; Number of Pins: 5P; Number of Rows: 1; Number of PINs Per Row: 5; Current Rating (Max): 3A; Contact Material: 黄铜; Contact Plating: 锡; Operating Temperature Range: -25℃~+85℃
H504 = ZX-XH2.54-6PWZ: 插针结构:1x6P;间距:2.54mm;安装方式:弯插;参考系列:XH;总PIN数:6P;排数:1;每排PIN数:6;行距:-;额定电流:3A;触头材质:黄铜;触头镀层:锡;工作温度范围:-25℃~+85℃;; Supplier Part: C7429645; Manufacturer: Megastar(兆星); Supplier Footprint: 弯插,P=2.54mm; JLCPCB Part Class: Extended Part; Datasheet: https://atta.szlcsc.com/upload/public/pdf/source/20230619/9057EB94260093B1525D11E652DE2D7A.pdf; Supplier: LCSC; Pins Structure: 1x6P; Pitch: 2.54mm; Mounting Style: 弯插; Reference Series: XH; Number of Pins: 6P; Number of Rows: 1; Number of PINs Per Row: 6; Current Rating (Max): 3A; Contact Material: 黄铜; Contact Plating: 锡; Operating Temperature Range: -25℃~+85℃
P302 P501-P511 = ZX-XH2.54-4PWZ: 插针结构:1x4P;间距:2.54mm;安装方式:弯插;参考系列:XH;总PIN数:4P;排数:1;每排PIN数:4;行距:-;额定电流:3A;触头材质:黄铜;触头镀层:锡;工作温度范围:-25℃~+85℃;; Supplier Part: C7429643; Manufacturer: Megastar(兆星); Supplier Footprint: 弯插,P=2.54mm; JLCPCB Part Class: Extended Part; Datasheet: https://atta.szlcsc.com/upload/public/pdf/source/20230619/8DC602C7BA46C153FF1BE89D90453879.pdf; Supplier: LCSC; Pins Structure: 1x4P; Pitch: 2.54mm; Mounting Style: 弯插; Reference Series: XH; Number of Pins: 4P; Number of Rows: 1; Number of PINs Per Row: 4; Current Rating (Max): 3A; Contact Material: 黄铜; Contact Plating: 锡; Operating Temperature Range: -25℃~+85℃
Q501 = SI2309: 类型:1个P沟道;漏源电压(Vdss):60V;连续漏极电流(Id):2A;导通电阻(RDS(on)@Vgs,Id):200mΩ@4.5V,1A;功率(Pd):800mW;阈值电压(Vgs(th)@Id):1V@250uA;; LCSC Part Name: 1个P沟道 耐压:60V 电流:2A; Supplier Part: C431496; Manufacturer: BORN(伯恩半导体); Supplier Footprint: SOT-23-3L; JLCPCB Part Class: 扩展库; Datasheet: https://atta.szlcsc.com/upload/public/pdf/source/20230417/67D2D82F4D715F77AED4A1C975D90F0B.pdf; Supplier: LCSC; Type: 1个P沟道; Drain Source Voltage (Vdss): 60V; Continuous Drain Current (Id): 2A; Drain Source On Resistance (RDS(on)@Vgs,Id): 200mΩ@4.5V,1A; Power Dissipation (Pd): 800mW; Gate Threshold Voltage (Vgs(th)@Id): 1V@250uA; Total Gate Charge (Qg@Vgs): 5.4nC@30V; Input Capacitance (Ciss@Vds): 310pF@30V; Reverse Transfer Capacitance (Crss@Vds): 15pF@30V; Operating Temperature: -50℃~+150℃
R501 R502 = 0402WGF5101TCE: 电阻类型:厚膜电阻;阻值:5.1kΩ;精度:±1%;功率:62.5mW;最大工作电压:50V;温度系数:±100ppm/℃;; LCSC Part Name: 5.1kΩ ±1% 62.5mW 厚膜电阻; Supplier Part: C25905; Manufacturer: UNI-ROYAL(厚声); Supplier Footprint: 0402; Datasheet: https://atta.szlcsc.com/upload/public/pdf/source/20200306/C422600_1E6D84923E4A46A82E41ADD87F860B5C.pdf; Supplier: LCSC; Type: 厚膜电阻; Tolerance: ±1%; Power(Watts): 62.5mW; Overload Voltage (Max): 50V; Temperature Coefficient: ±100ppm/℃; Operating Temperature Range: -55℃~+155℃
R503 R504 = 0402WGF0000TCE: 阻值:0Ω;精度:±1%;功率:62.5mW;温度系数:±800ppm/℃;电阻类型:厚膜电阻;; LCSC Part Name: 0Ω ±1% 62.5mW 厚膜电阻; Supplier Part: C17168; Manufacturer: UNI-ROYAL(厚声); Supplier Footprint: 0402; JLCPCB Part Class: 基础库; Datasheet: https://atta.szlcsc.com/upload/public/pdf/source/20200306/C422600_1E6D84923E4A46A82E41ADD87F860B5C.pdf; Supplier: LCSC; Tolerance: ±1%; Power(Watts): 62.5mW; Overload Voltage (Max): 50V; Temperature Coefficient: ±800ppm/℃; Type: 厚膜电阻; Operating Temperature Range: -55℃~+155℃
R507 R508 = 0603WAF1004T5E: 电阻类型:厚膜电阻;阻值:1MΩ;精度:±1%;功率:100mW;最大工作电压:75V;温度系数:±100ppm/℃;; LCSC Part Name: 1MΩ ±1% 100mW 厚膜电阻; Supplier Part: C22935; Manufacturer: UNI-ROYAL(厚声); Supplier Footprint: 0603; JLCPCB Part Class: 基础库; Datasheet: https://atta.szlcsc.com/upload/public/pdf/source/20200306/C422600_1E6D84923E4A46A82E41ADD87F860B5C.pdf; Supplier: LCSC; Type: 厚膜电阻; Tolerance: ±1%; Power(Watts): 100mW; Overload Voltage (Max): 75V; Temperature Coefficient: ±100ppm/℃; Operating Temperature Range: -55℃~+155℃
U501 = CH340N: LCSC Part Name: USB转串口芯片 CH340; Supplier Part: C2977777; Manufacturer: WCH(南京沁恒); Supplier Footprint: SOP-8; JLCPCB Part Class: 扩展库; Datasheet: https://atta.szlcsc.com/upload/public/pdf/source/20230530/6E401E9554E9F5311886CC8B3F89B62E.pdf; Supplier: LCSC
USB501 = TYPE-C16PIN: Supplier: LCSC; Supplier Part: C393939; Manufacturer: SHOU HAN; JLCPCB Part Class: Extended Part; Library Name: chaoning_Integrated_Library
C201 C203 = GRM155R71H104KE14D: 容值:100nF;精度:±10%;额定电压:50V;材质(温度系数):X7R;; LCSC Part Name: 100nF ±10% 50V; Supplier Part: C77020; Manufacturer: muRata(村田); Supplier Footprint: 0402; Datasheet: https://atta.szlcsc.com/upload/public/pdf/source/20180326/C77020_39BD49C951FF1AF0DB1F1FAC5AC1E401.pdf; Supplier: LCSC; Tolerance: ±10%; Voltage Rated: 50V; Temperature Coefficient: X7R
C202 = CL05B104KO5NNNC: 容值:100nF;精度:±10%;额定电压:16V;材质(温度系数):X7R;; LCSC Part Name: 100nF ±10% 16V; Supplier Part: C1525; Manufacturer: SAMSUNG(三星); Supplier Footprint: 0402; JLCPCB Part Class: Basic Part; Datasheet: https://atta.szlcsc.com/upload/public/pdf/source/20160218/1457707763339.pdf; Supplier: LCSC; Tolerance: ±10%; Voltage Rated: 16V; Temperature Coefficient: X7R; Design Item ID: 0402 100nF (104) 10% 16V; Library Name: Miscellaneous Devices LC; ComponentLink1Description: 供应商链接; ComponentLink1URL: http://www.szlcsc.com/product/details_1877.html; SuppliersPartNumber: C1525
C204-C208 = CL10B224KA8NNNC: 容值:220nF;精度:±10%;额定电压:25V;材质(温度系数):X7R;; LCSC Part Name: 220nF ±10% 25V; Supplier Part: C21120; Manufacturer: SAMSUNG(三星); Supplier Footprint: 0603; JLCPCB Part Class: 基础库; Datasheet: https://atta.szlcsc.com/upload/public/pdf/source/20160218/1457707763339.pdf; Supplier: LCSC; Tolerance: ±10%; Voltage Rated: 25V; Temperature Coefficient: X7R
R203 R205 = 0402WGF1002TCE: 电阻类型:厚膜电阻;阻值:10kΩ;精度:±1%;功率:62.5mW;最大工作电压:50V;温度系数:±100ppm/℃;; LCSC Part Name: 10kΩ ±1% 62.5mW 厚膜电阻; Supplier Part: C25744; Manufacturer: UNI-ROYAL(厚声); Supplier Footprint: 0402; JLCPCB Part Class: Basic Part; Datasheet: https://atta.szlcsc.com/upload/public/pdf/source/20200306/C422600_1E6D84923E4A46A82E41ADD87F860B5C.pdf; Supplier: LCSC; Type: 厚膜电阻; Tolerance: ±1%; Power(Watts): 62.5mW; Overload Voltage (Max): 50V; Temperature Coefficient: ±100ppm/℃; Operating Temperature Range: -55℃~+155℃; Design Item ID: 0402 10KΩ (1002) 1%; Library Name: 医疗床PCB; ComponentLink1Description: 供应商链接; ComponentLink1URL: http://www.szlcsc.com/product/details_26487.html; SuppliersPartNumber: C25744
R204 R209 = 0402WGF1200TCE: 电阻类型:厚膜电阻;阻值:120Ω;精度:±1%;功率:62.5mW;最大工作电压:50V;温度系数:±100ppm/℃;; LCSC Part Name: 120Ω ±1% 62.5mW 厚膜电阻; Supplier Part: C25079; Manufacturer: UNI-ROYAL(厚声); Supplier Footprint: 0402; JLCPCB Part Class: Basic Part; Datasheet: https://atta.szlcsc.com/upload/public/pdf/source/20200306/C422600_1E6D84923E4A46A82E41ADD87F860B5C.pdf; Supplier: LCSC; Type: 厚膜电阻; Tolerance: ±1%; Power(Watts): 62.5mW; Overload Voltage (Max): 50V; Temperature Coefficient: ±100ppm/℃; Operating Temperature Range: -55℃~+155℃; Design Item ID: 0402 10Ω (10R0) 1%; Library Name: Miscellaneous Devices LC; ComponentLink1Description: 供应商链接; ComponentLink1URL: http://www.szlcsc.com/product/details_25820.html; SuppliersPartNumber: C25077
R206 R208 = 0402WGF1001TCE: 电阻类型:厚膜电阻;阻值:1kΩ;精度:±1%;功率:62.5mW;最大工作电压:50V;温度系数:±100ppm/℃;; LCSC Part Name: 1kΩ ±1% 62.5mW 厚膜电阻; Supplier Part: C11702; Manufacturer: UNI-ROYAL(厚声); Supplier Footprint: 0402; JLCPCB Part Class: Basic Part; Datasheet: https://atta.szlcsc.com/upload/public/pdf/source/20200306/C422600_1E6D84923E4A46A82E41ADD87F860B5C.pdf; Supplier: LCSC; Type: 厚膜电阻; Tolerance: ±1%; Power(Watts): 62.5mW; Overload Voltage (Max): 50V; Temperature Coefficient: ±100ppm/℃; Operating Temperature Range: -55℃~+155℃; Design Item ID: 0402 1KΩ (1001) 1%; Library Name: 医疗床PCB; ComponentLink1Description: 供应商链接; ComponentLink1URL: http://www.szlcsc.com/product/details_12256.html; SuppliersPartNumber: C11702
R207 = 0402WGF1200TCE: 电阻类型:厚膜电阻;阻值:120Ω;精度:±1%;功率:62.5mW;最大工作电压:50V;温度系数:±100ppm/℃;; LCSC Part Name: 120Ω ±1% 62.5mW 厚膜电阻; Supplier Part: C25079; Manufacturer: UNI-ROYAL(厚声); Supplier Footprint: 0402; JLCPCB Part Class: Basic Part; Datasheet: https://atta.szlcsc.com/upload/public/pdf/source/20200306/C422600_1E6D84923E4A46A82E41ADD87F860B5C.pdf; Supplier: LCSC; Type: 厚膜电阻; Tolerance: ±1%; Power(Watts): 62.5mW; Overload Voltage (Max): 50V; Temperature Coefficient: ±100ppm/℃; Operating Temperature Range: -55℃~+155℃; Design Item ID: 0402 120Ω (1200) 1%; Library Name: 医疗床PCB; ComponentLink1Description: 供应商链接; ComponentLink1URL: http://www.szlcsc.com/product/details_25822.html; SuppliersPartNumber: C25079
U202 U204 = RS2251XTSS16: 开关电路:单刀八掷(SP8T);通道数:1;导通电阻(Ron@VCC):58Ω;; LCSC Part Name: 模拟开关RS2251XTSS16; Supplier Part: C255480; Manufacturer: RUNIC(润石); Supplier Footprint: TSSOP-16; Datasheet: https://atta.szlcsc.com/upload/public/pdf/source/20180801/C255480_EC867D29EB1A4F363C13FF925A2ED242.pdf; Supplier: LCSC; Switch Circuit: 单刀八掷(SP8T); Number of Channels: 1; Supply Voltage: 2.5V~5.5V; Turn-on time: 65ns; On-State Resistance (Max): 58Ω; Turn-off time: 80ns
U203 = SSP3485: 低功耗RS485收发器，速率10Mbps; Supplier Part: C2845064; Manufacturer: Siproin(上海矽朋); Supplier Footprint: SOP-8; JLCPCB Part Class: Extended Part; Datasheet: https://atta.szlcsc.com/upload/public/pdf/source/20220525/9F5C0B43AE697F097D5572C2C622EA91.pdf; Supplier: LCSC; Library Name: abbott_wei_base
U205 = SP3232EEN: 类型:收发器;驱动器/接收器:2/2;数据速率:250Kbps;; LCSC Part Name: 3.0V至5.5V低功率多通道RS-232线收发器 使用0.1μF外部电容; Supplier Part: C2904739; Manufacturer: UMW(友台半导体); Supplier Footprint: SOP-16; JLCPCB Part Class: 扩展库; Datasheet: https://atta.szlcsc.com/upload/public/pdf/source/20240122/238E83A7FACD35D5900508085B93A751.pdf; Supplier: LCSC; Types: 收发器; Driver/receiver: 2/2; Data Rate: 250Kbps; Supply Voltage: 3V~3.6V；4.5V~5.5V; Operating Temperature: 0℃~+70℃
R102 R113 = 0603WAF1001T5E: 电阻类型:厚膜电阻;阻值:1kΩ;精度:±1%;功率:100mW;最大工作电压:75V;温度系数:±100ppm/℃;; LCSC Part Name: 1kΩ ±1% 100mW 厚膜电阻; Supplier Part: C21190; Manufacturer: UNI-ROYAL(厚声); Supplier Footprint: 0603; JLCPCB Part Class: 基础库; Datasheet: https://atta.szlcsc.com/upload/public/pdf/source/20200306/C422600_1E6D84923E4A46A82E41ADD87F860B5C.pdf; Supplier: LCSC; Type: 厚膜电阻; Tolerance: ±1%; Power(Watts): 100mW; Overload Voltage (Max): 75V; Temperature Coefficient: ±100ppm/℃; Operating Temperature Range: -55℃~+155℃
R105 = 0603WAF1003T5E: 电阻类型:厚膜电阻;阻值:100kΩ;精度:±1%;功率:100mW;最大工作电压:75V;温度系数:±100ppm/℃;; LCSC Part Name: 100kΩ ±1% 100mW 厚膜电阻; Supplier Part: C25803; Manufacturer: UNI-ROYAL(厚声); Supplier Footprint: 0603; JLCPCB Part Class: Basic Part; Datasheet: https://atta.szlcsc.com/upload/public/pdf/source/20200306/C422600_1E6D84923E4A46A82E41ADD87F860B5C.pdf; Supplier: LCSC; Type: 厚膜电阻; Tolerance: ±1%; Power(Watts): 100mW; Overload Voltage (Max): 75V; Temperature Coefficient: ±100ppm/℃; Operating Temperature Range: -55℃~+155℃
U101-U103 = TLV2371IDBVR: 放大器数:单路;增益带宽积(GBP):3MHz;输入偏置电流(Ib):1pA;压摆率(SR):2.1V/us;带宽(-3db):-;轨到轨:-;; Supplier Part: C55940; Manufacturer: TI(德州仪器); Supplier Footprint: SOT-23-5; JLCPCB Part Class: 扩展库; Datasheet: https://www.ti.com/cn/lit/gpn/tlv2370; Supplier: LCSC; Number of Circuits: 单路; Gain Bandwidth Product(GBP): 3MHz; Current - Input Bias(Ib): 1pA; Slew Rate(SR): 2.1V/us; Output Current: 16mA; Operating Temperature: -40℃~+125℃

## Nets
GND: BUZZER1.2 C101.1 C102.1 C103.1 C104.1 C105.1 C106.1 C107.1 C108.1 C201.2 C202.1 C203.2 C204.2 C205.1 C208.2 C301.2 C302.2 C303.2 C304.2 C305.2 C306.1 C401.1 C402.2 C403.1 C404.1 C405.1 C406.1 C407.1 C408.2 C409.1 C410.1 C501.2 C502.1 C503.1 C505.1 C507.2 C508.2 C509.2 C510.1 C512.1 C513.1 C515.2 D402.1(K) D403.1(K) H501.3 H503.1 H503.4 H504.5 H505.3 H506.3 K101.8 K102.5 K102.8 K103.8 K601.8 K602.8 K603.8 K604.8 K605.8 K606.8 L6.2 L7.2 L8.2 P303.1 P303.2 P503.1 P503.2 P504.4 P505.4 P506.4 P508.1 R106.1 R107.2 R108.2 R109.2 R206.2 R403.2 R501.1 R502.1 R506.1 R508.1 R604.2 R605.2 R606.2 R612.2 R613.2 R617.2 R619.1 R621.1 U101.2(GND) U102.2(GND) U103.2(GND) U202.6(#ENABLE) U202.8(GND) U203.5(GND) U204.6(#ENABLE) U204.8(GND) U205.15(GND) U301.3(OUT-) U302.2(GND) U401.8(VSSA) U401.23(VSS_1) U401.35(VSS_2) U401.47(VSS_3) U501.3(GND) U505.3(OUT-) USB501.1(SHELL) USB501.2(SHELL) USB501.3(SHELL) USB501.4(SHELL) USB501.A1B12(GND) USB501.B1A12(GND) X401.2(GND) X401.4(GND)
PGND: C504.1 C506.2 C511.1 C514.2 DC302.2 L6.1 L7.1 L8.1 P301.3 P301.4 P302.1 P302.2 P502.4 P507.1 P509.3 P510.3 P511.3 U301.1(IN-) U505.1(IN-)
VCC_3V3: C202.2 C204.1 C401.2 C402.1 C403.2 C404.2 C405.2 C406.2 C407.2 C502.2 K103.6 Q1.2 R203.2 R205.1 R208.1 R301.2 R401.1 R404.1 R405.1 U203.8(VCC) U205.16(VCC) U401.1(VBAT) U401.9(VDDA) U401.24(VDD_1) U401.36(VDD_2) U401.48(VDD_3) U501.5(VCC) U501.8(V3)
VCC_5V: C201.1 C203.1 C301.1 C302.1 C303.1 C505.2 C507.1 H501.2 H502.2 H503.5 H504.6 H505.2 H506.2 P504.1 P505.1 P506.1 P508.4 Q101.2(S) Q501.3(D) Q601.2(S) Q602.2(S) Q603.2(S) Q604.2(S) Q605.2(S) R105.2 R302.1 R601.2 R602.2 R603.2 R610.2 R611.2 R623.1 R624.2 R625.2 R626.2 U202.16(VCC) U204.16(VCC) U301.4(OUT+) U302.1(IN)
VCC_12V: C510.2 K606.6 R622.1 U505.4(OUT+)
VCC_12V_OP1: C101.2 K606.7 U101.5(VDD)
VCC_12V_OP2: C106.2 K606.5 U103.5(VDD)
VCC_24V: C504.2 C506.1 C511.2 C514.1 L3.2 P302.3 P302.4 P502.1 P507.4 P509.4 P510.4 P511.4 R507.2 U301.2(IN+) U505.2(IN+)
VCC_DPM8605: C508.1 C509.1 K103.3 P303.3 P303.4
VCC_DPM_1: K101.2 K103.2
VCC_DPM_2: K101.4 K103.4
VCC_OP_1: C102.2 C103.2 K103.7 U101.3(IN+) U102.5(VDD)
485_DIR: R205.2 U203.2(RE#) U203.3(DE) U401.11(PA1)
485_RX: R204.1 U204.5(X5)
485_TX: R209.1 U202.5(X5)
ADC0: C105.2 K606.2 R104.2
ADC1: C108.2 K606.4 R115.2
BEEP: R7.2 U401.45(PB8)
BOOT0: R402.2 R403.1 U401.44(BOOT0)
DIVIDER_R_A: C515.1 K101.5 K102.4 R118.1 U103.3(IN+)
IN0: K606.3 P503.3 P503.4
IO_CONTROL: Q101.3(D) R110.1 R111.1 R112.1 R616.1
KEY1_A: CN2.10 K601.3
KEY1_B: CN2.9 K601.4
KEY1_CONTROL: Q601.3(D) R607.1
KEY2_A: CN2.8 K602.3
KEY2_B: CN2.7 K602.4
KEY2_CONTROL: Q602.3(D) R608.1
KEY3_A: CN2.6 K603.3
KEY3_B: CN2.5 K603.4
KEY3_CONTROL: Q603.3(D) R609.1
KEY4_A: CN2.4 K604.3
KEY4_B: CN2.3 K604.4
KEY4_CONTROL: Q604.3(D) R614.1
KEY5_A: CN2.2 K605.3
KEY5_B: CN2.1 K605.4
KEY5_CONTROL: Q605.3(D) R615.1
LED_GREEN: D401.K U401.2(PC13-TAMPER-RTC)
MCU_232_1_RX: U204.13(X0) U205.12(R1OUT)
MCU_232_1_TX: U202.13(X0) U205.11(T1IN)
MCU_IO_CONTROL: Q101.1(G) R105.1 U401.25(PB12)
MCU_IO_KEY1: Q601.1(G) R601.1 U401.43(PB7)
MCU_IO_KEY2: Q602.1(G) R602.1 U401.42(PB6)
MCU_IO_KEY3: Q603.1(G) R603.1 U401.40(PB4)
MCU_IO_KEY4: Q604.1(G) R610.1 U401.39(PB3)
MCU_IO_KEY5: Q605.1(G) R611.1 U401.38(PA15)
MOTOR_1_RX: P509.1 U204.12(X3)
MOTOR_1_TX: P509.2 U202.12(X3)
MOTOR_2_RX: P510.1 U204.15(X2)
MOTOR_2_TX: P510.2 U202.15(X2)
MOTOR_3_RX: P511.1 U204.14(X1)
MOTOR_3_TX: P511.2 U202.14(X1)
NRST: C410.2 R405.2 U401.7(NRST)
OAP_R_A: K101.7 K102.2 U101.4(IN-)
OAP_R_B: K102.7 R103.2 U101.1(OUT)
OSC_IN: C408.1 U401.5(PD0-OSCIN) X401.3(OSC2)
OSC_OUT: C409.2 U401.6(PD1-OSCOUT) X401.1(OSC1)
P_ADC_1: C503.2 R505.1 R506.2 U401.15(PA5)
P_ADC_2: C512.2 R618.1 R619.2 U401.16(PA6)
P_ADC_3: C513.2 R620.1 R621.2 U401.17(PA7)
P_OUT_1: H501.1 R505.2
P_OUT_2: H505.1 R618.2
P_OUT_3: H506.1 R620.2
PROGRAMME_R_A: H504.1 K102.3
PROGRAMME_R_B: H504.2 K102.6
RS232_1_RX: P508.2 U205.13(R1IN)
RS232_1_TX: P508.3 U205.14(T1OUT)
RS485_A: H504.3 P507.3 R207.2 R208.2 U203.6(A)
RS485_B: H504.4 P507.2 R206.1 R207.1 U203.7(B)
RS2251_A: R624.1 U202.11(A) U204.11(A) U401.28(PB15)
RS2251_B: R625.1 U202.10(B) U204.10(B) U401.27(PB14)
RS2251_C: R626.1 U202.9(C) U204.9(C) U401.26(PB13)
SENSER_A: K101.3 P501.1 P501.2
SENSER_B: K101.6 P501.3 P501.4
SWCLK: P505.3 U401.37(PA14)
SWDIO: P505.2 U401.34(PA13)
UART0_RX: P504.3 U401.31(PA10) U501.6(TXD)
UART0_TX: P504.2 U401.30(PA9) U501.7(RXD)
UART1_RX: H503.2 P502.3 U401.13(PA3)
UART1_TX: H503.3 P502.2 U401.12(PA2)
UART2_ESP32_RX: P506.3 U204.1(X4)
UART2_ESP32_TX: P506.2 U202.1(X4)
UART2_RX: U204.3(X) U401.22(PB11)
UART2_TX: U202.3(X) U401.21(PB10)
USB_D+: R503.1 U501.1(UD+)
USB_D-: R504.1 U501.2(UD-)
$1N1697: R113.1 U103.4(IN-)
$1N1702: C107.2 R113.2 R115.1 R118.2 U103.1(OUT)
$1N2148: C104.2 R101.2 R102.2 R104.1 U102.1(OUT)
$1N2190: R102.1 U102.4(IN-)
$1N2193: R101.1 R103.1 R106.2 U102.3(IN+)
$1N3772: K101.1 R107.1 R110.2
$1N3874: K102.1 R108.1 R111.2
$1N5503: K103.1 R109.1 R112.2
$1N9152: K606.1 R616.2 R617.1
$2N584: R209.2 U203.4(DI)
$2N588: R203.1 R204.2 U203.1(RO)
$2N1547: C206.2 U205.1(C1+)
$2N1551: C206.1 U205.3(C1-)
$2N1557: C205.2 U205.2(V+)
$2N1615: C208.1 U205.6(V-)
$2N1744: C207.2 U205.4(C2+)
$2N1748: C207.1 U205.5(C2-)
$3N818: C306.2 R302.2 U302.3(EN)
$3N819: C304.1 C305.1 R301.1 U302.5(OUT)
$3N960: DC302.1 L3.1 P301.1 P301.2
$4N2174: R401.2 R402.1
$4N2187: D401.A R404.2
$4N3393: BUZZER1.1 Q1.3
$4N3394: Q1.1 R7.1
$4N5108: D402.2(A) R622.2
$4N5354: D403.2(A) R623.2
$5N2667: R503.2 USB501.A6(DP1) USB501.B6(DP2)
$5N2668: R501.2 USB501.A5(CC1)
$5N2669: R504.2 USB501.A7(DN1) USB501.B7(DN2)
$5N2670: R502.2 USB501.B5(CC2)
$5N2672: C501.1 F501.2 USB501.A4B9(VBUS) USB501.B4A9(VBUS)
$5N2884: F501.1 H502.1 Q501.2(S)
$5N3843: Q501.1(G) R507.1 R508.2
$6N449: K601.1 R604.1 R607.2
$6N859: K602.1 R605.1 R608.2
$6N1269: K603.1 R606.1 R609.2
$6N1679: K604.1 R612.1 R614.2
$6N2089: K605.1 R613.1 R615.2

Not connected (* = marked no-connect by the designer): DC302 3*; K103 5*; K601 2* 5* 6* 7*; K602 2* 5* 6* 7*; K603 2* 5* 6* 7*; K604 2* 5* 6* 7*; K605 2* 5* 6* 7*; U202 2(X6)* 4(X7)* 7(NC)*; U204 2(X6)* 4(X7)* 7(NC)*; U205 7(T2OUT)* 8(R2IN)* 9(R2OUT)* 10(T2IN)*; U302 4(BYP)*; U401 3(PC14-OSC32IN)* 4(PC15-OSC32OUT)* 10(PA0-WKUP)* 14(PA4)* 18(PB0)* 19(PB1)* 20(PB2)* 29(PA8)* 32(PA11)* 33(PA12)* 41(PB5)* 46(PB9)*; U501 4(RTS#)*; USB501 A8(SBU1)* B8(SBU2)*

## Notes on the sheets
sheet 1
- 恒压采集
- Vadc=VCC_0-[R1*(VCC_DPM-VCC_0)/Rsensor]
- R_OAP需要选取更小的阻值获得更大的测试量程
- ADS1256的IN的输出范围0~3V，需要进行分压后输入
- Vadc=12-[R1*(7)/Rsensor]
- Σ-Δ ADC的输入阻抗性能优秀，理论可以省掉电压跟随器，取决与buffer ON或者buffer OFF
- 运放的供电是否需要做开关控制？
- 运放的上下电时序，避免出现：
  1.运放无供电情况下，IN-和IN+存在电压；
  2.运放供电，IN+和IN-长时间悬空；
  3.运放的IN-和IN+超出VDD情况；
- 控制分压后电压不得超过3V
- VCC_DPM8605电压区间（3.3V~15.3V）
  实现传感器两端电压（0~12V）
- Vth（-0.4，-0.7，-1）
- 配置开漏模式，IO拉低切换到分压模式
  MCU IO选用注意5V耐压
- 分压采集
- 连接到ADS1256的IN0
- 分压最终输出的Vadc注意不能超过3V
  调整VCC_DPM8605 MAX=3V是最安全的做法
- 控制分压后电压不得超过3V
sheet 2
- UART2-选通器
- RS485
- RE#和DE需要分开吗
- RS232
sheet 3
- LDO 3V3
- DC 24V
- BUCK 5V
- 程控电源
- BUCK 12V
- VCC_DPM8605电压区间（3.3V~15.3V）
  实现传感器两端电压（0~12V）
- 输入
sheet 4
- 2.1 MCU
- 2.4 BEEP
- 2.2 Crystal oscillator
- 2.3 LED
- 2.4 RESET
sheet 5
- 传感器接口
- 堵转保护传感器
- USB
- RS232
- 挤压P_OUT输出约4.8V，MCU ADC检测
- 与24V供电互斥，请勿使用24V供电情况下短接
- Vth（-1，-1.5，-2.5）
- 当24V不在位，Vgs=-5V，PMOS打开
- 当24V在位，Vgs=7V，PMOS关闭
- 电机1#
- 电机2#
- 电机3#
- 压力传感器
- ADC采集板
- 总数据上传to ESP32
- 下载/调试
- JTAG
- RS485编程电阻
- RS485程控电源
- 供电
- 软件调试稳定后，此口用于数据上传ESP32
sheet 6
- Vth（-0.4，-0.7，-1）
- Vth（-0.4，-0.7，-1）
- Vth（-0.4，-0.7，-1）
- 配置开漏模式，IO拉低，按键按下触发
- 配置开漏模式，IO拉低，按键按下触发
- 配置开漏模式，IO拉低，按键按下触发
- Vth（-0.4，-0.7，-1）
- Vth（-0.4，-0.7，-1）
- 配置开漏模式，IO拉低，按键按下触发
- 配置开漏模式，IO拉低，按键按下触发
